# EasyEDA Pro project 内机V10_1.epro, schematic 内机底板_1, sheets 4 to 6 of 6

## Sheets
4 ETHERNET: Page Size: A4
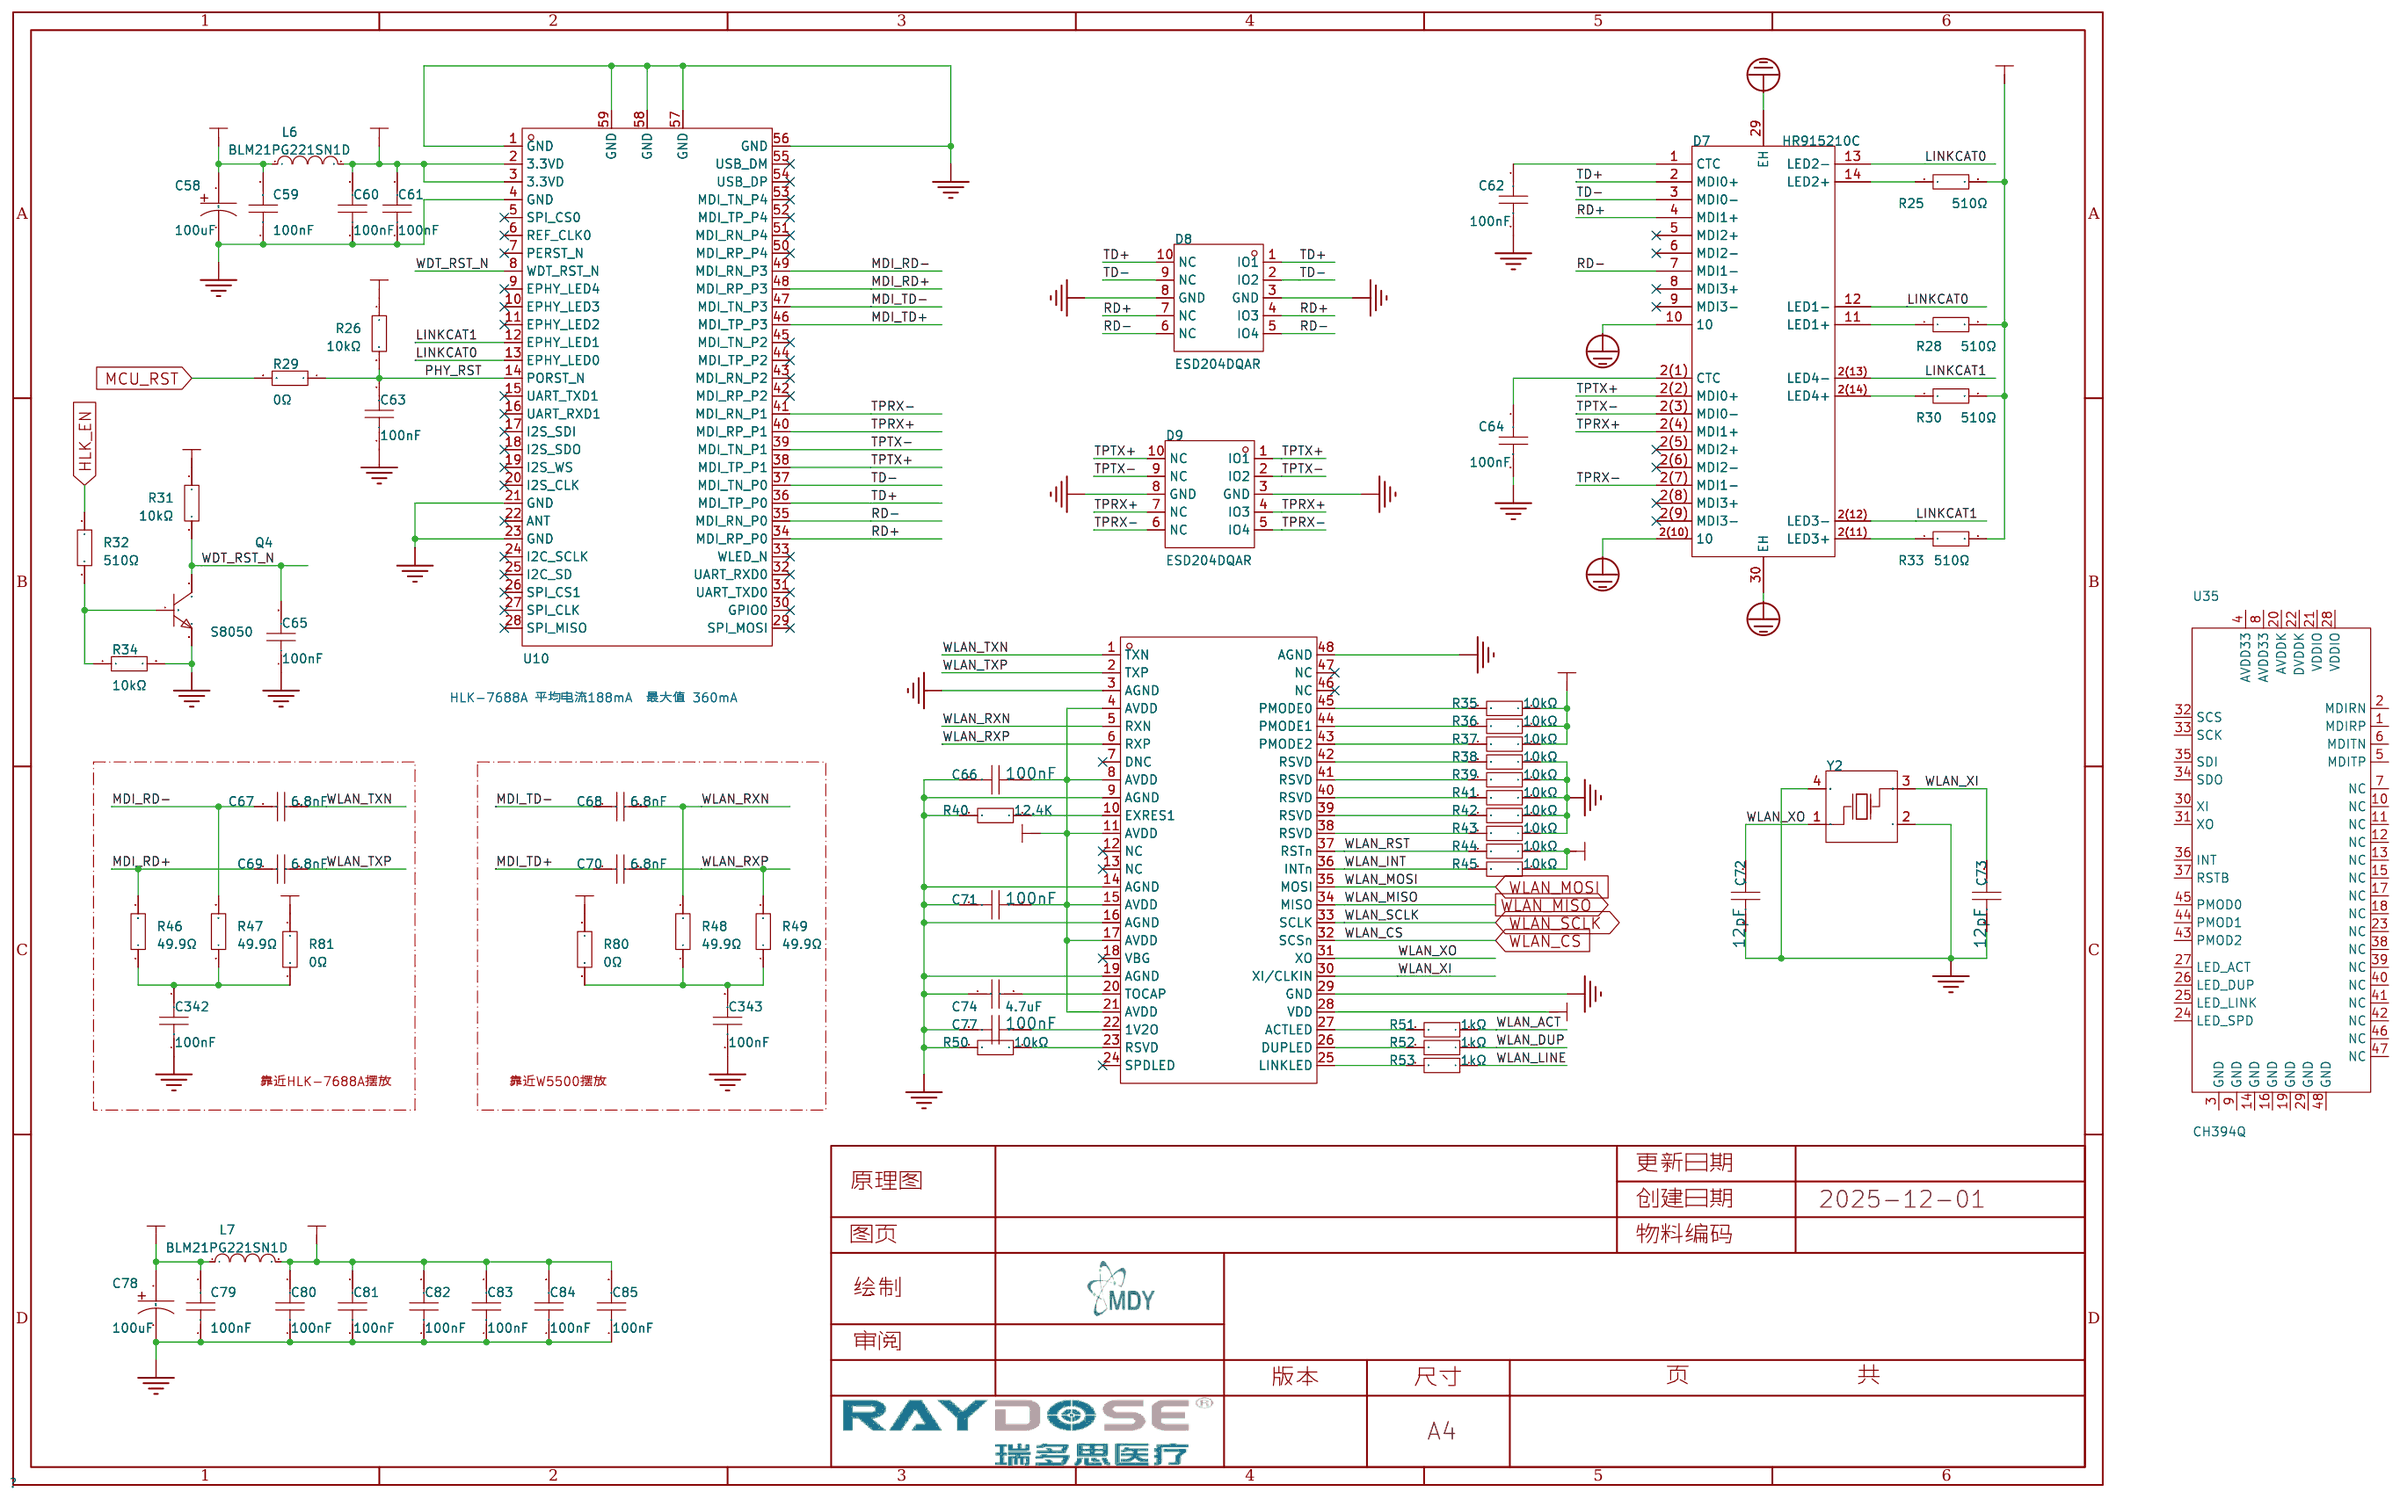
[diagram p3: ETHERNET]
5 INTERFACE
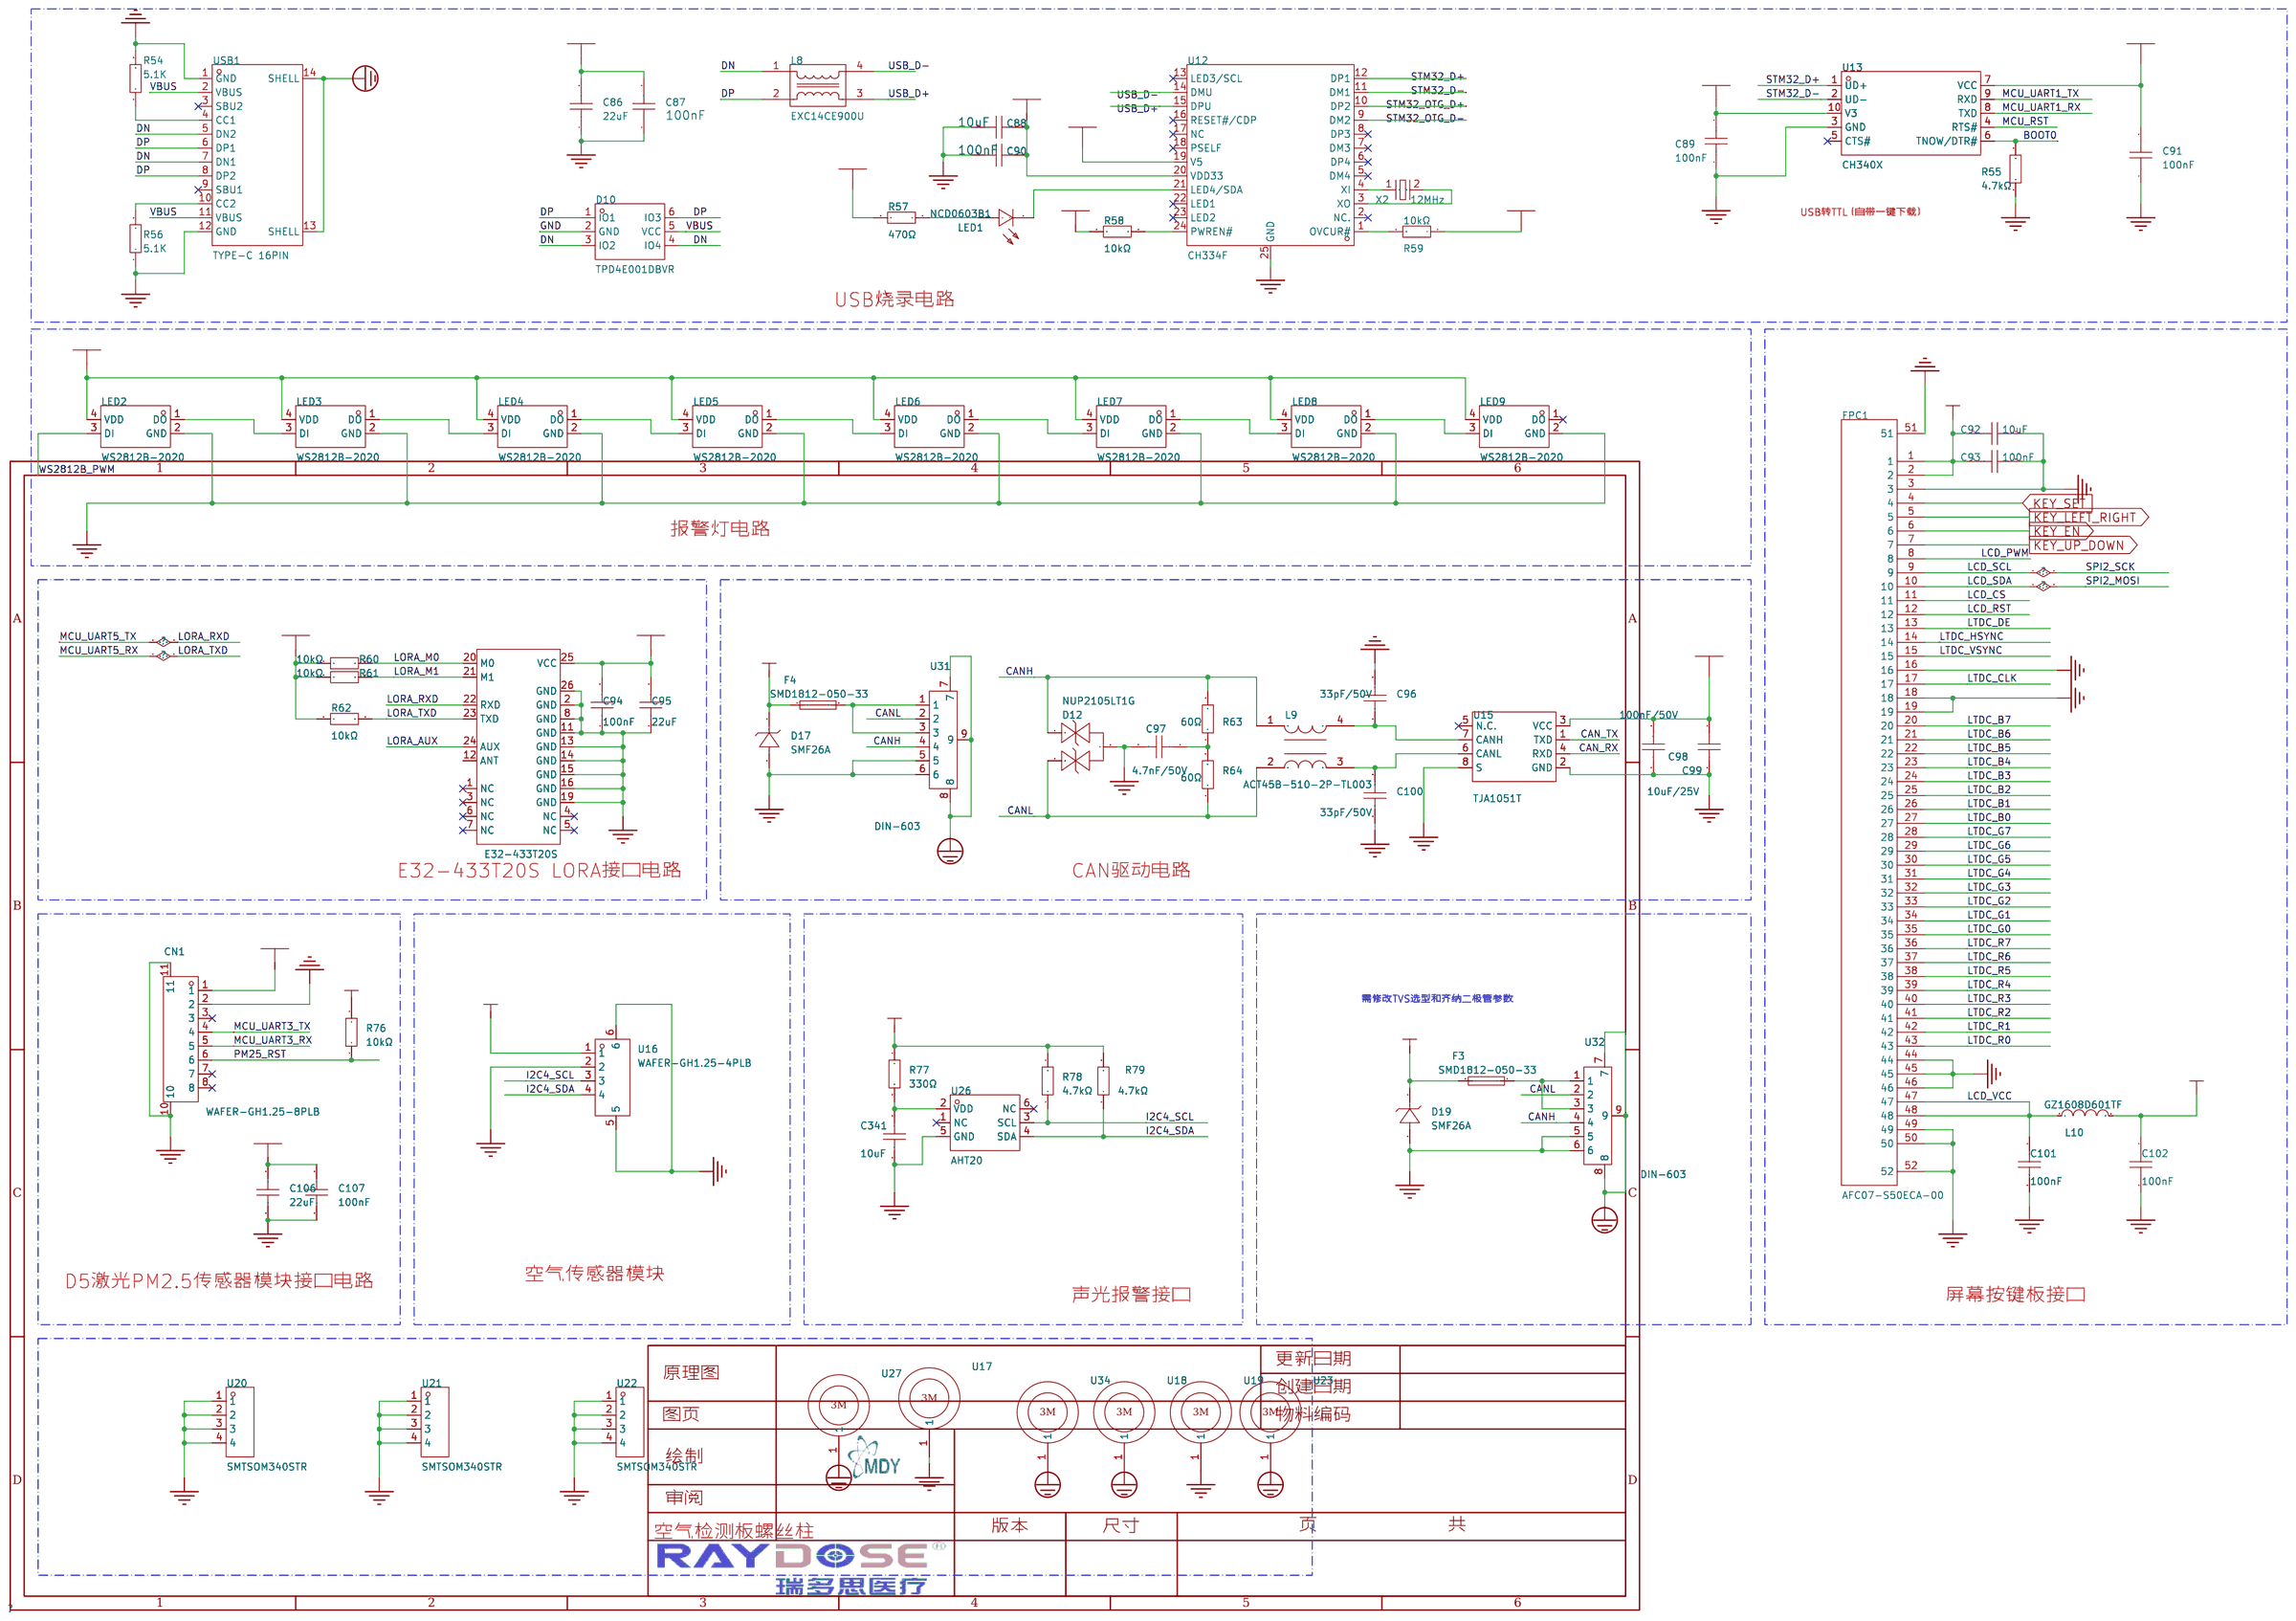
[diagram p4: INTERFACE]
6 SENSORS: Board Name: 内机V10; Create Date: 2025-09-10
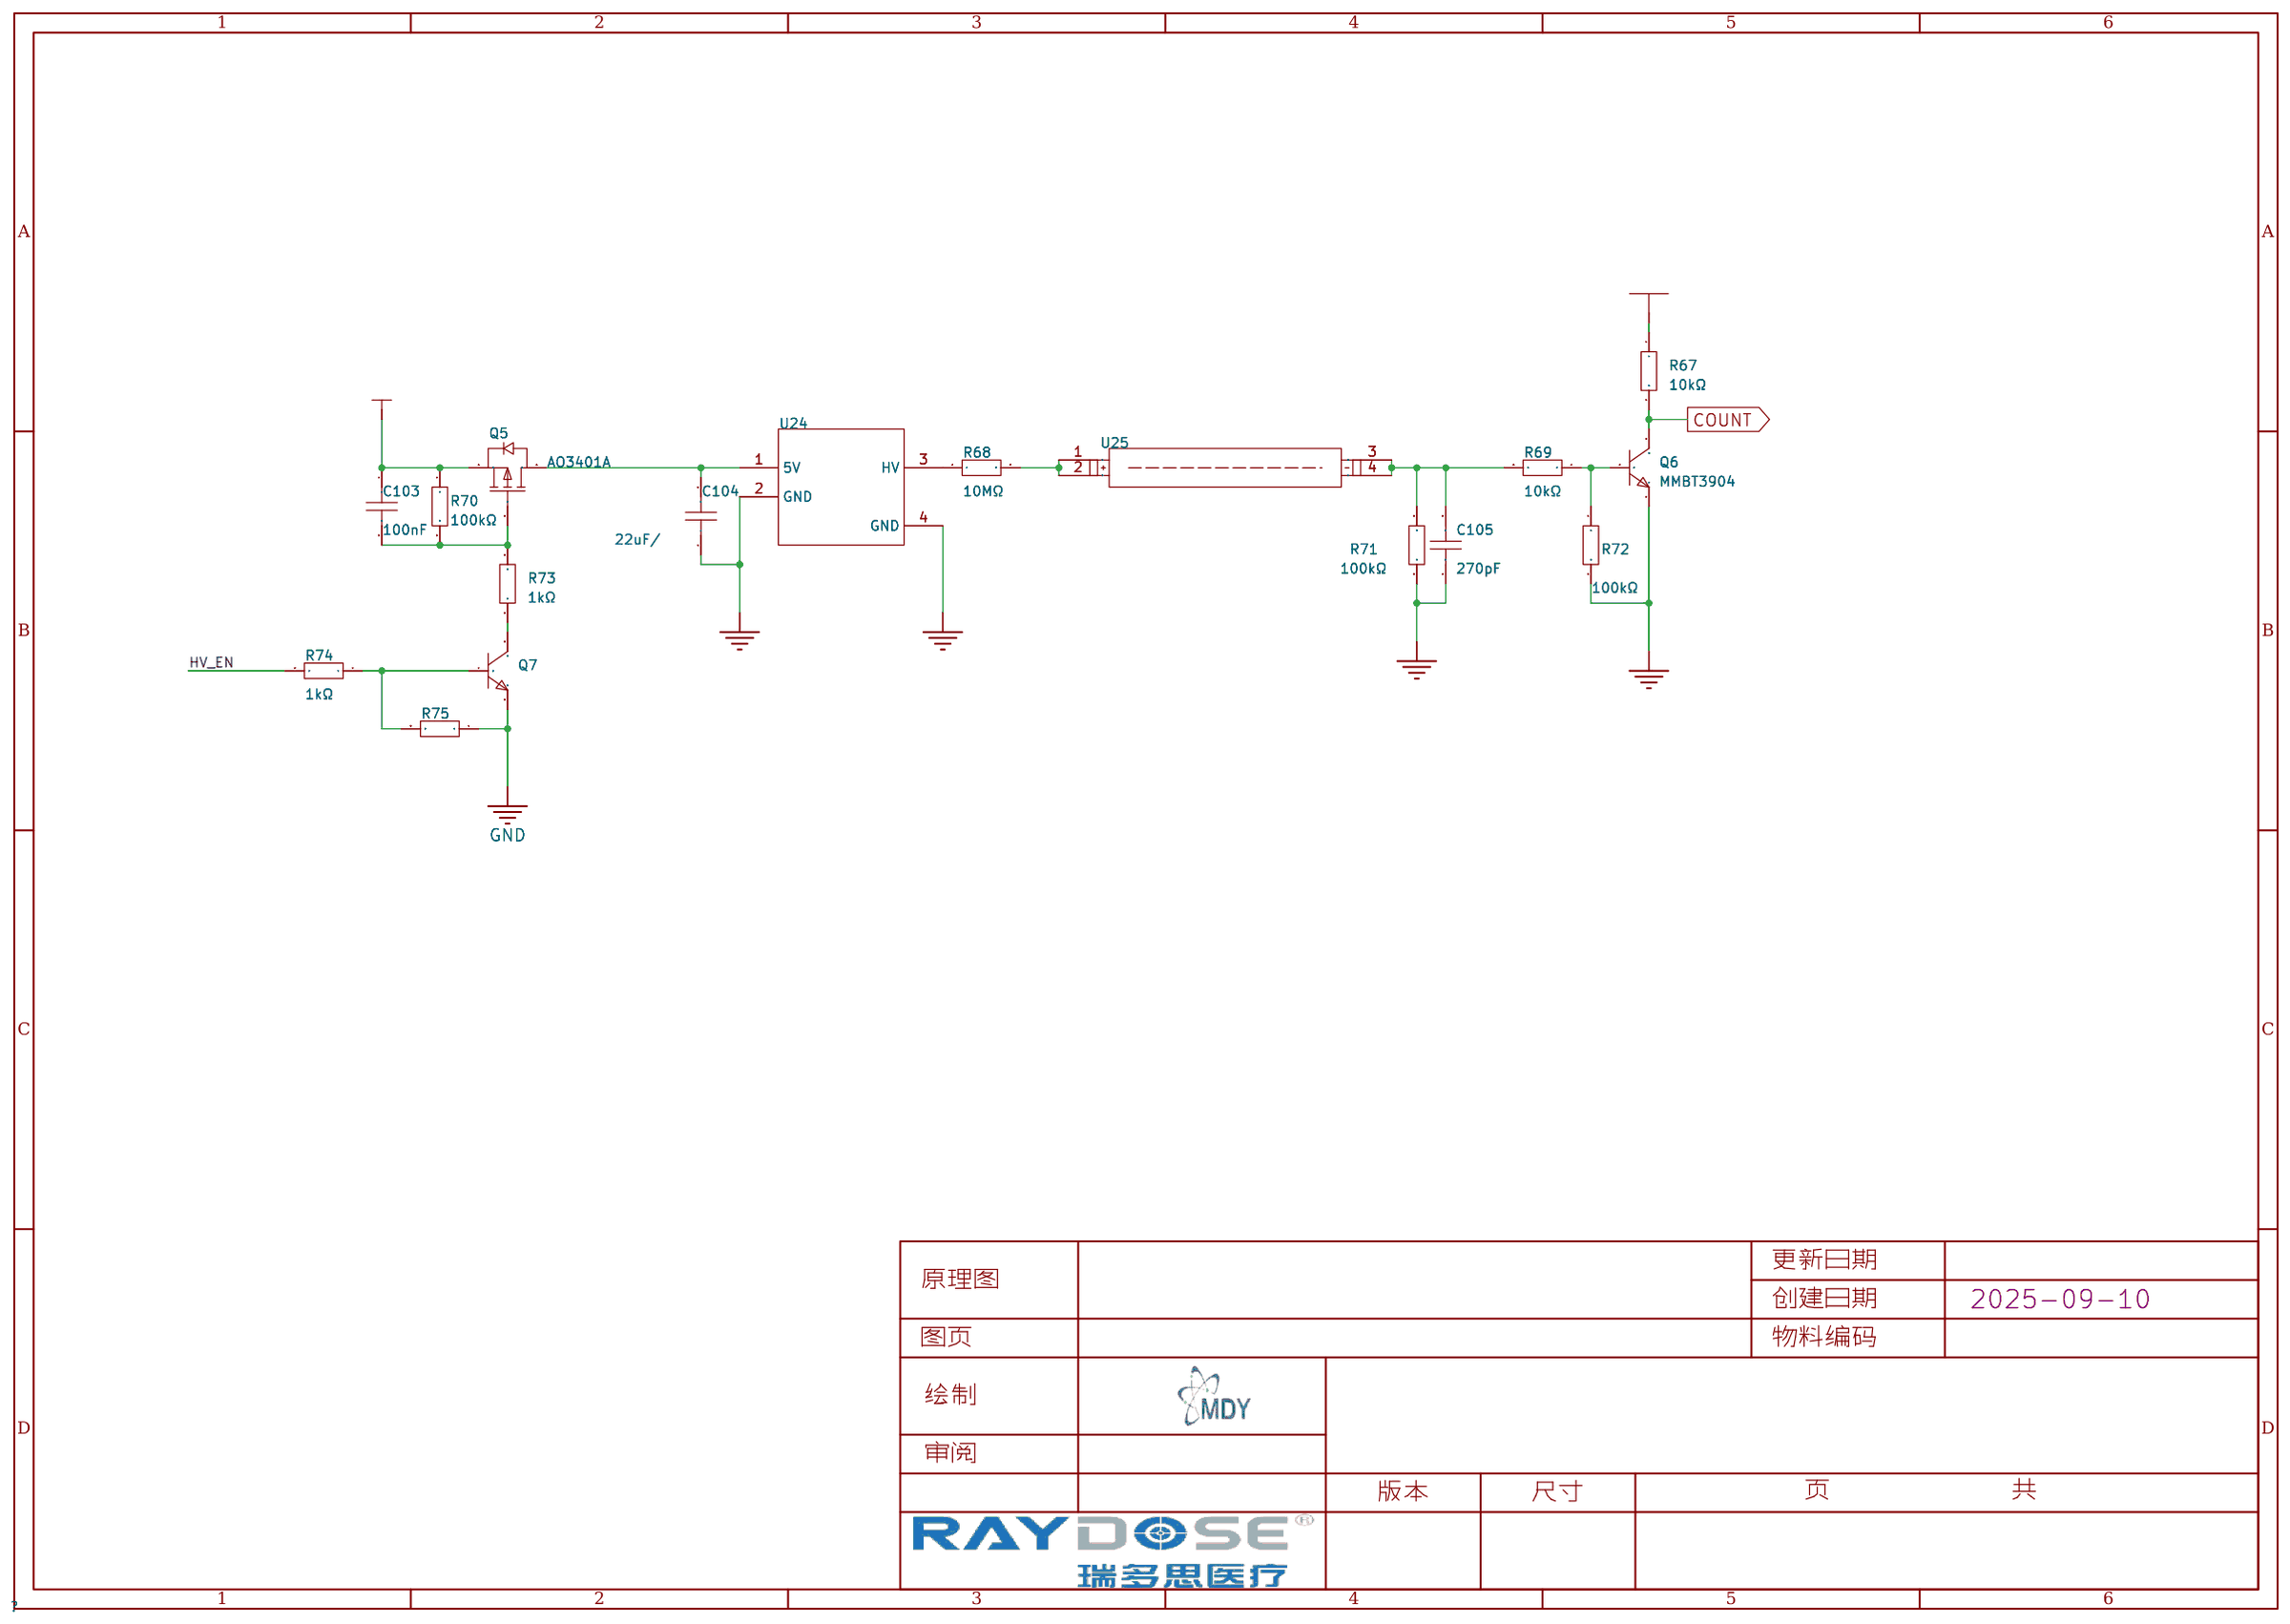
[diagram p5: SENSORS]

## Parts
sheet ETHERNET
C58  100uF  [CASE-B_3528]
C59  100nF  [C0603]
C60  100nF  [C0603]
C61  100nF  [C0603]
C62  100nF  [C0603]
C63  100nF  [C0603]
C64  100nF  [C0603]
C65  100nF  [C0603]
C66  100nF  [C0603]
C67  6.8nF  [C0603]
C68  6.8nF  [C0603]
C69  6.8nF  [C0603]
C70  6.8nF  [C0603]
C71  100nF  [C0603]
C72  12pF  [C0603_1]
C73  12pF  [C0603_1]
C74  4.7uF  [C0603]
C77  100nF  [C0603]
C78  100uF  [CASE-B_3528]
C79  100nF  [C0603]
C80  100nF  [C0603]
C81  100nF  [C0603]
C82  100nF  [C0603]
C83  100nF  [C0603]
C84  100nF  [C0603]
C85  100nF  [C0603]
C342  100nF  [C0603]
C343  100nF  [C0603]
D7  HR915210C  [RJ45-TH_HR915210C]
D8  ESD204DQAR  [USON-10_L2.5-W1.0-P0.50-BL]
D9  ESD204DQAR  [USON-10_L2.5-W1.0-P0.50-BL]
L6  BLM21PG221SN1D  [L0805]
L7  BLM21PG221SN1D  [L0805]
Q4  S8050  [SOT-23-3_L3.0-W1.7-P0.95-LS2.9-BR]
R25  510Ω  [R0603]
R26  10kΩ  [R0603]
R28  510Ω  [R0603]
R29  0Ω  [R0603]
R30  510Ω  [R0603]
R31  10kΩ  [R0603]
R32  510Ω  [R0603]
R33  510Ω  [R0603]
R34  10kΩ  [R0603]
R35  10kΩ  [R0603]
R36  10kΩ  [R0603]
R37  10kΩ  [R0603]
R38  10kΩ  [R0603]
R39  10kΩ  [R0603]
R40  12.4K  [R0603]
R41  10kΩ  [R0603]
R42  10kΩ  [R0603]
R43  10kΩ  [R0603]
R44  10kΩ  [R0603]
R45  10kΩ  [R0603]
R46  49.9Ω  [R0603]
R47  49.9Ω  [R0603]
R48  49.9Ω  [R0603]
R49  49.9Ω  [R0603]
R50  10kΩ  [R0603]
R51  1kΩ  [R0603]
R52  1kΩ  [R0603]
R53  1kΩ  [R0603]
R80  0Ω  [R0603]
R81  0Ω  [R0603]
U10  2.412GHz；2.483GHz  [WIRELM-SMD_HLK-7688A]
U11  W5500  [LQFP-48_L7.0-W7.0-P0.50-LS9.0-BL]
U35  CH394Q  [LQFP-48_L7.0-W7.0-P0.50-LS9.0-TL]
Y2  25MHz  [CRYSTAL-SMD_4P-L3.2-W2.5-BL]
sheet INTERFACE
C86  22uF  [C0603_1]
C87  100nF  [C0603]
C88  10uF  [C0603]
C89  100nF  [C0603]
C90  100nF  [C0603]
C91  100nF  [C0603]
C92  10uF  [C0603]
C93  100nF  [C0603]
C94  100nF  [C0603]
C95  22uF  [C0805]
C96  33pF  [C0603]
C97  4.7nF  [C0603]
C98  100nF  [C0603]
C99  10uF  [C0805]
C100  33pF  [C0603]
C101  100nF  [C0603]
C102  100nF  [C0603]
C106  22uF  [C0805]
C107  100nF  [C0603]
C341  10uF  [C0603]
CN1  WAFER-GH1.25-8PLB  [CONN-SMD_8P-P1.25_WAFER-GH1.25-8PLB]
D10  TPD4E001DBVR  [SOT-23-6_L2.9-W1.6-P0.95-LS2.8-BL]
D12  NUP2105LT1G  [SOT-23-3_L2.9-W1.3-P1.90-LS2.4-BR]
D17  SMF26A  [SOD-123_L2.6-W1.8-LS3.7-RD]
D19  SMF26A  [SOD-123_L2.6-W1.8-LS3.7-RD]
F3  SMD1812-050-33  [F1812]
F4  SMD1812-050-33  [F1812]
FPC1  AFC07-S50ECA-00  [FPC-SMD_AFC07-S50ECA-00]
L8  EXC14CE900U  [FILTER-SMD_4P-L0.9-W0.7-P0.50-BL]
L9  ACT45B-510-2P-TL003  [IND-SMD_4P-L4.5-W3.2-TL]
L10  GZ1608D601TF  [L0603]
LED1  NCD0603B1  [LED0603-RD]
LED2  WS2812B-2020  [LED-SMD_4P-L2.0-W2.0-TL_WS2812B-2020]
LED3  WS2812B-2020  [LED-SMD_4P-L2.0-W2.0-TL_WS2812B-2020]
LED4  WS2812B-2020  [LED-SMD_4P-L2.0-W2.0-TL_WS2812B-2020]
LED5  WS2812B-2020  [LED-SMD_4P-L2.0-W2.0-TL_WS2812B-2020]
LED6  WS2812B-2020  [LED-SMD_4P-L2.0-W2.0-TL_WS2812B-2020]
LED7  WS2812B-2020  [LED-SMD_4P-L2.0-W2.0-TL_WS2812B-2020]
LED8  WS2812B-2020  [LED-SMD_4P-L2.0-W2.0-TL_WS2812B-2020]
LED9  WS2812B-2020  [LED-SMD_4P-L2.0-W2.0-TL_WS2812B-2020]
R54  5.1K  [R0603]
R55  4.7kΩ  [R0603]
R56  5.1K  [R0603]
R57  470Ω  [R0603]
R58  10kΩ  [R0603]
R59  10kΩ  [R0603]
R60  10kΩ  [R0603]
R61  10kΩ  [R0603]
R62  10kΩ  [R0603]
R63  60Ω  [R0603]
R64  60Ω  [R0603]
R76  10kΩ  [R0603]
R77  330Ω  [R0603]
R78  4.7kΩ  [R0603]
R79  4.7kΩ  [R0603]
U12  CH334F  [QFN-24_L4.0-W4.0-P0.50-BL-EP2.8]
U13  CH340X  [MSOP-10_L3.0-W3.0-P0.50-LS5.0-BL]
U14  E32-433T20S  [WIRELM-SMD_E32-433T20S]
U15  TJA1051T  [SOP-8_L4.9-W3.9-P1.27-LS6.0-BL]
U16  WAFER-GH1.25-4PLB  [CONN-SMD_4P-P1.25_XUNPU_WAFER-GH1.25-4PLB]
U17  -  [3M螺丝孔]
U18  -  [3M螺丝孔]
U19  -  [3M螺丝孔]
U20  SMTSOM340STR  [SMD_BD6.2-D4.1]
U21  SMTSOM340STR  [SMD_BD6.2-D4.1]
U22  SMTSOM340STR  [SMD_BD6.2-D4.1]
U23  -  [3M螺丝孔]
U26  AHT20  [SENSOR-SMD_L3.0-W3.0-P1.00-BR]
U27  -  [3M螺丝孔]
U31  DIN-603  [PS2-TH_DIN_603]
U32  DIN-603  [PS2-TH_DIN_603]
U34  -  [3M螺丝孔]
USB1  TYPE-C 16PIN  [USB-C-SMD_TYPE-C-6PIN-2MD-073]
X2  12MHz  [CRYSTAL-SMD_L5.0-W3.2-1]
sheet SENSORS
C103  100nF  [C0603]
C104  22uF  [C0805]
C105  270pF  [C1206]
Q5  AO3401A  [SOT-23_L2.9-W1.3-P1.90-LS2.4-BR]
Q6  MMBT3904  [SOT-23-3_L2.9-W1.3-P1.90-LS2.4-BR]
Q7  S8050 J3Y(RANGE:200-350)  [SOT-23-3_L3.0-W1.7-P0.95-LS2.9-BR]
R67  10kΩ  [R0603]
R68  10MΩ  [R0805]
R69  10kΩ  [R0603]
R70  100kΩ  [R0603]
R71  100kΩ  [R0805]
R72  100kΩ  [R0603]
R73  1kΩ  [R0603]
R74  1kΩ  [R0603]
R75  10kΩ  [R0603]
U24  -  [反激电源模块_5v升压400v]
U25  -  [盖革管4313]

## Library data of the parts
C58 C78 = T491B107K010AT: 容值:100uF;精度:±10%;额定电压:10V;等效串联电阻:1.2Ω@100kHz;; LCSC Part Name: 100uF ±10% 10V; Supplier Part: C122271; Manufacturer: KEMET(基美); Supplier Footprint: CASE-B-3528; JLCPCB Part Class: 扩展库; Datasheet: https://atta.szlcsc.com/upload/public/pdf/source/20171212/C146203_15130638656111177810.pdf; Supplier: LCSC; Tolerance: ±10%; Rated Voltage: 10V; Equivalent Series Resistance(ESR): 1.2Ω@100kHz; Operating Temperature: -55℃~+125℃
C59-C65 C79-C85 C89 C91 C93 C94 C107 C342 C343 = CC0603KRX7R9BB104: 容值:100nF;精度:±10%;额定电压:50V;材质(温度系数):X7R;; LCSC Part Name: 100nF ±10% 50V; Supplier Part: C14663; Manufacturer: YAGEO(国巨); Supplier Footprint: 0603; JLCPCB Part Class: 基础库; Datasheet: https://atta.szlcsc.com/upload/public/pdf/source/20180910/C282072_33301C7F631E79921B82A8DAC6BCC5B3.pdf; Supplier: LCSC; Tolerance: ±10%; Voltage Rated: 50V; Temperature Coefficient: X7R
C66 C71 C77 C87 C90 = CC0603KRX7R9BB104: 容值:100nF;精度:±10%;额定电压:50V;温度系数:X7R;; LCSC Part Name: 100nF ±10% 50V; Supplier Part: C14663; Manufacturer: YAGEO(国巨); Supplier Footprint: 0603; JLCPCB Part Class: 基础库; Datasheet: https://atta.szlcsc.com/upload/public/pdf/source/20180910/C282072_33301C7F631E79921B82A8DAC6BCC5B3.pdf; Supplier: LCSC; Tolerance: ±10%; Voltage Rated: 50V; Temperature Coefficient: X7R; Check: true; Voltage Rating: 50V
C67-C70 = 0603B682K500NT: 容值:6.8nF;精度:±10%;额定电压:50V;温度系数:X7R;; LCSC Part Name: 6.8nF ±10% 50V; Supplier Part: C1631; Manufacturer: FH(风华); Supplier Footprint: 0603; JLCPCB Part Class: 基础库; Datasheet: https://atta.szlcsc.com/upload/public/pdf/source/20200305/C486355_26A10D38EF8C2A5C37091D0039909270.pdf; Supplier: LCSC; Tolerance: ±10%; Voltage Rating: 50V; Temperature Coefficient: X7R
C72 C73 = 0603B104K500NT: 容值:100nF;精度:±10%;额定电压:50V;材质(温度系数):X7R;; LCSC Part Name: 100nF ±10% 50V; Supplier Part: C30926; Manufacturer: FH(风华); Supplier Footprint: 0603; JLCPCB Part Class: Extended Part; Datasheet: https://atta.szlcsc.com/upload/public/pdf/source/20170923/C30926_1506149436298988724.pdf; Supplier: LCSC; Tolerance: ±10%; Voltage Rated: 50V; Temperature Coefficient: X7R; Check: true
C74 = CL10A475KO8NNNC: 容值:4.7uF;精度:±10%;额定电压:16V;材质(温度系数):X5R;; LCSC Part Name: 4.7uF ±10% 16V; Supplier Part: C19666; Manufacturer: SAMSUNG(三星); Supplier Footprint: 0603; JLCPCB Part Class: 基础库; Datasheet: https://atta.szlcsc.com/upload/public/pdf/source/20160218/1457707763339.pdf; Supplier: LCSC; Tolerance: ±10%; Voltage Rated: 16V; Temperature Coefficient: X5R
D7 = HR915210C: 连接器类型:RJ45插座;端口数量:2;安装方式:弯插;屏蔽:有屏蔽;LED:带LED;等级:-;触头材质:-;触头镀层:-;工作温度范围:0℃~+70℃;焊接温度(最大值):-;; LCSC Part Name: 弯插 带LED; Supplier Part: C2760331; Manufacturer: HANRUN(汉仁); Supplier Footprint: 插件; JLCPCB Part Class: 扩展库; Datasheet: https://atta.szlcsc.com/upload/public/pdf/source/20210316/C2760331_4D9CC28882E2EACAC9CE7FA17F2B9B05.pdf; Supplier: LCSC; Connector Type: RJ45插座; Number of Ports: 2; Mounting Style: 弯插; Shielding: 有屏蔽; LED: 带LED; Operating Temperature Range: 0℃~+70℃
D8 D9 = ESD204DQAR: 反向截止电压(Vrwm):3.6V;最大钳位电压:11.5V;峰值脉冲功率(Ppp)@10/1000us:50W;击穿电压:5V;; Supplier Part: C553132; Manufacturer: TI(德州仪器); Supplier Footprint: USON-10(1x2.5); JLCPCB Part Class: 扩展库; Datasheet: https://www.ti.com/cn/lit/gpn/esd204; Supplier: LCSC; Reverse Stand-Off Voltage (Vrwm): 3.6V; Maximum Clamping Voltage: 11.5V; Peak Pulse Power Dissipation (Ppp)@10/1000us: 50W; Breakdown Voltage: 5V; Operating Temperature: -40℃~+125℃@(Ta); Type: ESD
L6 L7 = BLM21PG221SN1D: 标称阻抗@测试频率:220Ω@100MHz;误差:±25%;直流电阻(RDC):45mΩ;; LCSC Part Name: 单路 0805磁珠 阻抗220Ω@100MHz; Supplier Part: C85840; Manufacturer: muRata(村田); Supplier Footprint: 0805; JLCPCB Part Class: 扩展库; Datasheet: https://atta.szlcsc.com/upload/public/pdf/source/20180326/C118443_3FAC30E9A4F0E6B81275543C61E0685E.pdf; Supplier: LCSC; Impedance @ Frequency: 220Ω@100MHz; Tolerance: ±25%; DC Resistance: 45mΩ; Current Rating: 2A; Circuits: 1
Q4 = S8050 J3Y(RANGE:200-350): 晶体管类型:NPN;集电极电流(Ic):500mA;集射极击穿电压(Vceo):25V;耗散功率(Pd):300mW;直流电流增益(hFE):200@500mA,1V;; LCSC Part Name: H档(200-350) NPN 电流:0.5A 电压:25V; Supplier Part: C2146; Manufacturer: CJ(江苏长电/长晶); Supplier Footprint: SOT-23; JLCPCB Part Class: 基础库; Datasheet: https://item.szlcsc.com/datasheet/S8050%2520J3Y(RANGE%253A200-350)/2503.html; Supplier: LCSC; type: NPN; Current - Collector(Ic): 500mA; Collector - Emitter Voltage VCEO: 25V; Pd - Power Dissipation: 300mW; DC Current Gain: 200@500mA,1V; Transition frequency(fT): 150MHz; Current - Collector Cutoff: 100nA; Vce Saturation(VCE(sat)): 600mV@500mA,50mA; Operating Temperature: -55℃~+150℃; Emitter-Base Voltage(Vebo): 5V; Number: 1个NPN
R25 R28 R30 R32 R33 = 0603WAF5100T5E: 电阻类型:厚膜电阻;阻值:510Ω;精度:±1%;功率:100mW;最大工作电压:75V;温度系数:±100ppm/℃;; LCSC Part Name: 510Ω ±1% 100mW 厚膜电阻; Supplier Part: C23193; Manufacturer: UNI-ROYAL(厚声); Supplier Footprint: 0603; JLCPCB Part Class: 基础库; Datasheet: https://atta.szlcsc.com/upload/public/pdf/source/20200306/C422600_1E6D84923E4A46A82E41ADD87F860B5C.pdf; Supplier: LCSC; Type: 厚膜电阻; Tolerance: ±1%; Power(Watts): 100mW; Overload Voltage (Max): 75V; Temperature Coefficient: ±100ppm/℃; Operating Temperature Range: -55℃~+155℃
R26 R31 R34 R60-R62 R67 R69 R75 R76 = 0603WAF1002T5E: 电阻类型:厚膜电阻;阻值:10kΩ;精度:±1%;功率:100mW;最大工作电压:75V;温度系数:±100ppm/℃;; LCSC Part Name: 厚膜电阻 10kΩ ±1% 100mW; Supplier Part: C25804; Manufacturer: UNI-ROYAL(厚声); Supplier Footprint: 0603; JLCPCB Part Class: Basic Part; Datasheet: https://atta.szlcsc.com/upload/public/pdf/source/20200306/C422600_1E6D84923E4A46A82E41ADD87F860B5C.pdf; Supplier: LCSC; Type: 厚膜电阻; Tolerance: ±1%; Power(Watts): 100mW; Overload Voltage (Max): 75V; Temperature Coefficient: ±100ppm/℃; Operating Temperature Range: -55℃~+155℃
R29 R80 R81 = 0603WAF0000T5E: 电阻类型:厚膜电阻;阻值:0Ω;精度:±1%;功率:100mW;最大工作电压:75V;; LCSC Part Name: 0Ω ±1% 100mW 厚膜电阻; Supplier Part: C21189; Manufacturer: UNI-ROYAL(厚声); Supplier Footprint: 0603; JLCPCB Part Class: 基础库; Datasheet: https://atta.szlcsc.com/upload/public/pdf/source/20200306/C422600_1E6D84923E4A46A82E41ADD87F860B5C.pdf; Supplier: LCSC; Type: 厚膜电阻; Tolerance: ±1%; Power(Watts): 100mW; Overload Voltage (Max): 75V; Operating Temperature Range: -55℃~+155℃
R35-R39 R41-R45 R50 R58 R59 = 0603WAF1002T5E: 电阻类型:厚膜电阻;阻值:10kΩ;精度:±1%;功率:100mW;最大工作电压:75V;温度系数:±100ppm/℃;; LCSC Part Name: 厚膜电阻 10kΩ ±1% 100mW; Supplier Part: C25804; Manufacturer: UNI-ROYAL(厚声); Supplier Footprint: 0603; JLCPCB Part Class: Basic Part; Datasheet: https://atta.szlcsc.com/upload/public/pdf/source/20200306/C422600_1E6D84923E4A46A82E41ADD87F860B5C.pdf; Supplier: LCSC; Type: 厚膜电阻; Tolerance: ±1%; Power(Watts): 100mW; Overload Voltage (Max): 75V; Temperature Coefficient: ±100ppm/℃; Operating Temperature Range: -55℃~+155℃; Check: true
R40 = AECR0805F1M00K9: 电阻类型:厚膜电阻;阻值:1M;精度:±1%;功率:125mW;温度系数:±100ppm/;最大工作电压:150V;工作温度范围:-55~+125;; LCSC Part Name: 0R; Supplier Part: C328386; Manufacturer: RESI(开步睿思）; Supplier Footprint: 0805; Datasheet: https://atta.szlcsc.com/upload/public/pdf/source/20181108/C328386_8056536101292A650F3268E3B3E068CE.pdf; Supplier: LCSC; Type: 厚膜电阻; Tolerance: ±1%; Power(Watts): 125mW; Temperature Coefficient: ±100ppm/; Overload Voltage (Max): 150V; Operating Temperature Range: -55~+125; JLCPCB Part Class: Extended Part; Check: true
R46-R49 = 0603WAF499JT5E: 电阻类型:厚膜电阻;阻值:49.9Ω;精度:±1%;功率:100mW;工作电压:75V;温度系数:±100ppm/℃;; LCSC Part Name: 49.9Ω ±1% 100mW 厚膜电阻; Supplier Part: C23185; Manufacturer: UNI-ROYAL(厚声); Supplier Footprint: 0603; JLCPCB Part Class: 基础库; Datasheet: https://item.szlcsc.com/datasheet/0603WAF499JT5E/23912.html; Supplier: LCSC; Type: 厚膜电阻; Tolerance: ±1%; Power(Watts): 100mW; Voltage-Supply(Max): 75V; Temperature Coefficient: ±100ppm/℃; Operating Temperature: -55℃~+155℃
R51-R53 = 0603WAF1001T5E: 电阻类型:厚膜电阻;阻值:1kΩ;精度:±1%;功率:100mW;最大工作电压:75V;温度系数:±100ppm/℃;; LCSC Part Name: 1kΩ ±1% 100mW 厚膜电阻; Supplier Part: C21190; Manufacturer: UNI-ROYAL(厚声); Supplier Footprint: 0603; JLCPCB Part Class: Basic Part; Datasheet: https://atta.szlcsc.com/upload/public/pdf/source/20200306/C422600_1E6D84923E4A46A82E41ADD87F860B5C.pdf; Supplier: LCSC; Type: 厚膜电阻; Tolerance: ±1%; Power(Watts): 100mW; Overload Voltage (Max): 75V; Temperature Coefficient: ±100ppm/℃; Operating Temperature Range: -55℃~+155℃; Check: true
U10 = HLK-7688A: 核心芯片:MT7688AN芯片;频率:2.412GHz；2.483GHz;天线形式:-;发射功率:20dBm;接收灵敏度:-;; LCSC Part Name: 网口路由WIFI模块 天线配件HLK-TX-PCB-B; Supplier Part: C209919; Manufacturer: HI-LINK(海凌科); JLCPCB Part Class: 扩展库; Datasheet: https://atta.szlcsc.com/upload/public/pdf/source/20250327/6E4B9EDE596D8DAC5EED69D970B3F30A.pdf; Supplier: LCSC; Utilized IC / Part: MT7688AN芯片; Interface Type: UART；SPI；I2C；USB; Output Power: 20dBm; Voltage - Supply: 3.3V; Operating Temperature: -20℃~+60℃
U11 = W5500: 应用功能:控制器;通道数:-;接口类型:SPI;; LCSC Part Name: 硬连线TCP/IP嵌入式以太网控制器; Supplier Part: C32843; Manufacturer: WIZNET; Supplier Footprint: LQFP-48(7x7); JLCPCB Part Class: 扩展库; Datasheet: https://atta.szlcsc.com/upload/public/pdf/source/20230714/E10C32B058E0BA54FCE1C1556BE10C07.pdf; Supplier: LCSC; Application Function: 控制器; Interface: SPI; Supply Voltage: 2.97V~3.63V; Supply Current: 132mA; Operating Temperature: -40℃~+85℃
U35 = CH394Q: TCP/IP以太网协议栈芯片，通过SPI接口拓展以太网通信功能。集成10/100M MAC和PHY收发器，支持Auto-MDIX，内置ARP、ICMP、IGMP、UDP、TCP等协议固件，提供8个socket，I/O口支持3.3V、2.5V、1.8V供电。; LCSC Part Name: 以太网协议栈芯片; Supplier Part: C46061830; Manufacturer: WCH(南京沁恒); Supplier Footprint: LQFP-48(7x7); JLCPCB Part Class: 扩展库; Datasheet: https://item.szlcsc.com/datasheet/CH394Q/48170819.html; Supplier: LCSC; Number of Channels: 8; Voltage - Supply: 1.8V；3.3V；2.5V; Integrated PHY: 是; Communication Interface: SPI; Memory Space: 32KB; Ethernet Speed Standards: 10BASE-T；100BASE-TX
Y2 = X322525MOB4SI: 晶振类型:贴片晶振;频率:25MHz;常温频差:±10ppm;负载电容:12pF;频率稳定度:±20ppm;; LCSC Part Name: YSX321SL 25MHZ 4P 3225 12PF ±10PPM -40~85℃ (±20PPM); Supplier Part: C9006; Manufacturer: YXC(扬兴晶振); Supplier Footprint: SMD3225-4P; JLCPCB Part Class: Basic Part; Datasheet: https://atta.szlcsc.com/upload/public/pdf/source/20240329/19D5F850207469550BEB00D7DFEDBC7A.pdf; Supplier: LCSC; Crystal Type: 贴片晶振; Normal temperature Frequency Tolerance: ±10ppm; Load Capacitor: 12pF; Frequency Stability(Full temperature range): ±20ppm; Operating Temperature: -40℃~+85℃; External load capacitor: 12pF; Type: 贴片晶振; Load Capacitance: 12pF; Frequency Stability: ±20ppm
C86 = CGA0603X5R226M160JT: 容值:22uF;精度:±20%;额定电压:16V;温度系数:X5R;; LCSC Part Name: 22uF ±20% 16V; Supplier Part: C6119868; Manufacturer: HRE(芯声); Supplier Footprint: 0603; JLCPCB Part Class: Extended Part; Datasheet: https://atta.szlcsc.com/upload/public/pdf/source/20250121/36E435B8815E1026A710792D223DB526.pdf; Supplier: LCSC; Tolerance: ±20%; Voltage Rated: 16V; Temperature Coefficient: X5R; Voltage Rating: 16V
C88 = CL10A106MA8NRNC: 容值:10uF;精度:±20%;额定电压:25V;材质(温度系数):X5R;; LCSC Part Name: 10uF ±20% 25V; Supplier Part: C96446; Manufacturer: SAMSUNG(三星); Supplier Footprint: 0603; JLCPCB Part Class: 基础库; Datasheet: https://atta.szlcsc.com/upload/public/pdf/source/20160218/1457707763339.pdf; Supplier: LCSC; Tolerance: ±20%; Voltage Rated: 25V; Temperature Coefficient: X5R; Check: true
C92 = CL10A106KP8NNNC: 容值:10uF;精度:±10%;额定电压:10V;温度系数:X5R;; LCSC Part Name: 10uF ±10% 10V; Supplier Part: C19702; Manufacturer: SAMSUNG(三星); Supplier Footprint: 0603; JLCPCB Part Class: 基础库; Datasheet: https://item.szlcsc.com/datasheet/CL10A106KP8NNNC/20411.html; Supplier: LCSC; Tolerance: ±10%; Voltage Rating: 10V; Temperature Coefficient: X5R
C95 C104 C106 = CL21A226MAQNNNE: 容值:22uF;精度:±20%;额定电压:25V;材质(温度系数):X5R;; LCSC Part Name: 22uF ±20% 25V; Supplier Part: C45783; Manufacturer: SAMSUNG(三星); Supplier Footprint: 0805; JLCPCB Part Class: Basic Part; Datasheet: https://atta.szlcsc.com/upload/public/pdf/source/20160218/1457707763339.pdf; Supplier: LCSC; Tolerance: ±20%; Voltage Rated: 25V; Temperature Coefficient: X5R
C96 C100 = CL10C330JB8NNNC: 容值:33pF;精度:±5%;额定电压:50V;材质(温度系数):C0G;; LCSC Part Name: 33pF ±5% 50V; Supplier Part: C1663; Manufacturer: SAMSUNG(三星); Supplier Footprint: 0603; JLCPCB Part Class: 基础库; Datasheet: https://atta.szlcsc.com/upload/public/pdf/source/20160218/1457707763339.pdf; Supplier: LCSC; Tolerance: ±5%; Voltage Rated: 50V; Temperature Coefficient: C0G
C97 = 0603B472K500NT: 容值:4.7nF;精度:±10%;额定电压:50V;材质(温度系数):X7R;; LCSC Part Name: 4.7nF ±10% 50V; Supplier Part: C53987; Manufacturer: FH(风华); Supplier Footprint: 0603; JLCPCB Part Class: Basic Part; Datasheet: https://atta.szlcsc.com/upload/public/pdf/source/20200305/C486355_26A10D38EF8C2A5C37091D0039909270.pdf; Supplier: LCSC; Tolerance: ±10%; Voltage Rated: 50V; Temperature Coefficient: X7R
C98 C101-C103 = CC0603KRX7R9BB104: 容值:100nF;精度:±10%;额定电压:50V;材质(温度系数):X7R;; LCSC Part Name: 100nF ±10% 50V; Supplier Part: C14663; Manufacturer: YAGEO(国巨); Supplier Footprint: 0603; JLCPCB Part Class: Basic Part; Datasheet: https://atta.szlcsc.com/upload/public/pdf/source/20180910/C282072_33301C7F631E79921B82A8DAC6BCC5B3.pdf; Supplier: LCSC; Tolerance: ±10%; Voltage Rated: 50V; Temperature Coefficient: X7R
C99 = CL21A106KAYNNNE_C15850: 容值:10uF;精度:±10%;额定电压:25V;材质(温度系数):X5R;; LCSC Part Name: 10uF ±10% 25V; Supplier Part: C15850; Manufacturer: SAMSUNG(三星); Manufacturer Part: CL21A106KAYNNNE; Supplier Footprint: 0805; JLCPCB Part Class: Basic Part; Datasheet: https://atta.szlcsc.com/upload/public/pdf/source/20160218/1457707763339.pdf; Supplier: LCSC; Tolerance: ±10%; Voltage Rated: 25V; Temperature Coefficient: X5R
C341 = CL10A106MA8NRNC: 容值:10uF;精度:±20%;额定电压:25V;材质(温度系数):X5R;; LCSC Part Name: 10uF ±20% 25V; Supplier Part: C96446; Manufacturer: SAMSUNG(三星); Supplier Footprint: 0603; JLCPCB Part Class: 基础库; Datasheet: https://atta.szlcsc.com/upload/public/pdf/source/20160218/1457707763339.pdf; Supplier: LCSC; Tolerance: ±20%; Voltage Rated: 25V; Temperature Coefficient: X5R
CN1 = WAFER-GH1.25-8PLB: 插针结构:1x8P;间距:1.25mm;安装方式:立贴;参考系列:GH;总PIN数:8P;排数:1;每排PIN数:8;行距:-;额定电流:1A;触头材质:黄铜;触头镀层:-;工作温度:-25℃~+85℃;; LCSC Part Name: 1x8P 间距:1.25mm 立贴 系列:GH; Supplier Part: C3029374; Manufacturer: XUNPU(讯普); Supplier Footprint: SMD,P=1.25mm; JLCPCB Part Class: 扩展库; Datasheet: https://item.szlcsc.com/datasheet/WAFER-GH1.25-8PLB/3561386.html; Supplier: LCSC; Pins Structure: 1x8P; Pitch: 1.25mm; Mounting Type: 立贴; Reference Series: GH; Number of Pins: 8P; Number of Rows: 1; Number of PINs Per Row: 8; Current Rating: 1A; Contact Material: 黄铜; Operating Temperature: -25℃~+85℃; Voltage Rating: 125V; Plastic Material: LCP; Supplementary Features: 辅助焊脚; Color: 米色; Z-Height of the Board: 4.2mm; X-Length of Bottom Edge on Board (Spacing Line): 13.25mm; Y-Width of Bottom Edge on Board: 4.95mm
D10 = TPD4E001DBVR: 反向截止电压(Vrwm):5.5V;最大钳位电压:-;峰值脉冲功率(Ppp)@10/1000us:100W;击穿电压:11V;; Supplier Part: C465736; Manufacturer: TI(德州仪器); Supplier Footprint: SOT-23-6; JLCPCB Part Class: 扩展库; Datasheet: https://www.ti.com/cn/lit/gpn/tpd4e001; Supplier: LCSC; Reverse Stand-Off Voltage (Vrwm): 5.5V; Peak Pulse Power Dissipation (Ppp)@10/1000us: 100W; Breakdown Voltage: 11V; Operating Temperature: -40℃~+85℃@(Ta); Type: ESD
D12 = NUP2105LT1G_C2890118: Supplier Part: C2890118; Manufacturer: TECH PUBLIC(台舟); Supplier Footprint: SOT-23; JLCPCB Part Class: 扩展库; Datasheet: https://atta.szlcsc.com/upload/public/pdf/source/20210903/C2631C2D315C3B4D2530AFC6AAB84809.pdf; Supplier: LCSC
D17 D19 = SMF26A_C41376090: 极性:单向;反向截止电压(Vrwm):26V;钳位电压:42.1V;峰值脉冲电流(Ipp):4.8A;峰值脉冲功率(Ppp):200W;击穿电压:31.9V;; LCSC Part Name: 单向TVS 26V截止 峰值浪涌电流：4.8A; Supplier Part: C41376090; Manufacturer: 宏嘉诚; Supplier Footprint: SOD-123FL; JLCPCB Part Class: 扩展库; Datasheet: https://item.szlcsc.com/datasheet/SMF26A/43144807.html; Supplier: LCSC; Polarity: 单向; Reverse Stand-Off Voltage (Vrwm): 26V; Clamping Voltage: 42.1V; Peak Pulse Current (Ipp): 4.8A; Peak Pulse Power Dissipation (Ppp): 200W; Voltage - Breakdown: 31.9V; Reverse Leakage Current (Ir): 1uA; Number of Channels: 单路; Operating Temperature: -55℃~+150℃; level of protection: IEC 61000-4-2; Type: TVS
F3 F4 = SMD1812-050-33: 耐压(Vmax):33V;最大电流(Imax):40A;保持电流(Ihold):500mA;跳闸电流(Itrip):1A;; Supplier Part: C46641047; Manufacturer: 宏嘉诚; Supplier Footprint: 1812; JLCPCB Part Class: 扩展库; Datasheet: https://item.szlcsc.com/datasheet/SMD1812-050-33/48798753.html; Supplier: LCSC; Voltage - Max: 33V; Current - Max: 40A; Hold Current: 500mA; Trip Current: 1A; Power Dissipation: 1W; Resistance - Initial (Ri) (Min): 150mΩ; Resistance - Post Trip (R1) (Max): 1.4Ω; Time to Trip(Max): 150ms; Operating Temperature: -40℃~+85℃
FPC1 = AFC07-S50ECA-00: 锁定特性:抽屉式;触点类型:上接;触点数量:50P;间距:0.5mm;安装方式:卧贴;; LCSC Part Name: 间距:0.5mm P数:50P 抽屉式 上接; Supplier Part: C262650; Manufacturer: JS(钜硕电子); Supplier Footprint: SMD,P=0.5mm,卧贴; JLCPCB Part Class: 扩展库; Datasheet: https://item.szlcsc.com/datasheet/AFC07-S50ECA-00/253909.html; Supplier: LCSC; Locking Feature: 抽屉式; Contact Type: 上接; Number of Contacts: 50P; Pitch: 0.5mm; Mounting Type: 卧贴; FFC, FCB Thickness: 0.3mm; Height Above Board: 2mm
L8 = EXC14CE900U: 线路数:2;阻抗 @ 频率:90Ω@100MHz;直流电阻(DCR):2.5Ω;; LCSC Part Name: 两路 共模滤波器 阻抗90Ω@100MHz; Supplier Part: C178761; Manufacturer: PANASONIC(松下); Supplier Footprint: SMD-4P,0.8x0.6mm; JLCPCB Part Class: 扩展库; Datasheet: https://atta.szlcsc.com/upload/public/pdf/source/20180420/C178763_1B313D20029A4DF74B8E6D9ABB4E3A47.pdf; Supplier: LCSC; Number of Lines: 2; Withstanding Voltage: 125V; Current Rating: 130mA; Voltage Rating - DC: 5V; Impedance @ Frequency: 90Ω@100MHz; DC Resistance (DCR): 2.5Ω; Operating Temperature: -40℃~+85℃
L9 = ACT45B-510-2P-TL003: 线路数:2;电感 @ 频率:51uH@100kHz;阻抗 @ 频率:2.8kΩ@10MHz;直流电阻(DCR):1Ω;; LCSC Part Name: 两路 4532共模滤波器 阻抗2.8kΩ@10MHz; Supplier Part: C76584; Manufacturer: TDK; Supplier Footprint: SMD,4.5x3.2mm; JLCPCB Part Class: 扩展库; Datasheet: https://atta.szlcsc.com/upload/public/pdf/source/20160918/1474166842057.pdf; Supplier: LCSC; Number of Lines: 2; Withstanding Voltage: 250V@2Secs; Current Rating: 200mA; Inductance @ Frequency: 51uH@100kHz; Voltage Rating - DC: 50V; Impedance @ Frequency: 2.8kΩ@10MHz; DC Resistance (DCR): 1Ω; Operating Temperature: -40℃~+150℃
L10 = GZ1608D601TF: 阻抗 @ 频率:600Ω@100MHz;误差:±25%;直流电阻(DCR):450mΩ;; LCSC Part Name: 单路 0603磁珠 阻抗600Ω@100MHz; Supplier Part: C1002; Manufacturer: Sunlord(顺络); Supplier Footprint: 0603; JLCPCB Part Class: 基础库; Datasheet: https://atta.szlcsc.com/upload/public/pdf/source/20241120/893429B990C3BA07384E734821D2F218.pdf; Supplier: LCSC; Impedance @ Frequency: 600Ω@100MHz; Tolerance: ±25%; DC Resistance: 450mΩ; Current Rating: 200mA; Circuits: 1
LED1 = NCD0603B1: 发光颜色:蓝色;正向电压(VF):2.6V~3.6V;功率:72mW;正向电流:10mA;主波长:463nm~475nm;透镜颜色:无色透明透镜;发光强度:80mcd~220mcd;发光角度:130°;工作温度:-30℃~+85℃;; Supplier Part: C84266; Manufacturer: 国星光电; Supplier Footprint: 0603; JLCPCB Part Class: 扩展库; Datasheet: https://atta.szlcsc.com/upload/public/pdf/source/20200820/C84266_6A3CDBEFA72C6CAD68EDA53474ADAE6C.pdf; Supplier: LCSC; Emitted Color: 蓝色; Forward Voltage (VF): 2.6V~3.6V; Power Dissipation: 72mW; Forward Current: 10mA; Dominant Wavelength: 463nm~475nm; Lens Color: 无色透明透镜; Luminous Intensity: 80mcd~220mcd; Viewing Angle: 130°; Operating Temperature: -30℃~+85℃
LED2-LED9 = WS2812B-2020: 12mA，小尺寸，高亮，用于小间距，小尺寸产品（注意防潮，请查阅规格书中对应具体内容）; LCSC Part Name: RGB三色; Supplier Part: C965555; Manufacturer: worldsemi; Supplier Footprint: SMD,2.2x2mm; JLCPCB Part Class: 扩展库; Datasheet: https://item.szlcsc.com/datasheet/WS2812B-2020/1051115.html; Supplier: LCSC; Wavelength: 515.6nm；622.5nm；470.4nm; Luminous Intensity: 200mcd；160mcd；520mcd; Data Transmission Rate: 100KB/S; Voltage - Supply: 5V; Installation method: 正贴
R54 R56 = Res_0603: Supplier Footprint: 0603
R55 R78 R79 = 0603WAF4701T5E: 电阻类型:厚膜电阻;阻值:4.7kΩ;精度:±1%;功率:100mW;最大工作电压:75V;温度系数:±100ppm/℃;; LCSC Part Name: 4.7kΩ ±1% 100mW 厚膜电阻; Supplier Part: C23162; Manufacturer: UNI-ROYAL(厚声); Supplier Footprint: 0603; JLCPCB Part Class: Basic Part; Datasheet: https://atta.szlcsc.com/upload/public/pdf/source/20200306/C422600_1E6D84923E4A46A82E41ADD87F860B5C.pdf; Supplier: LCSC; Type: 厚膜电阻; Tolerance: ±1%; Power(Watts): 100mW; Overload Voltage (Max): 75V; Temperature Coefficient: ±100ppm/℃; Operating Temperature Range: -55℃~+155℃
R57 = 0603WAF4700T5E: 电阻类型:厚膜电阻;阻值:470Ω;精度:±1%;功率:100mW;最大工作电压:75V;温度系数:±100ppm/℃;; LCSC Part Name: 470Ω ±1% 100mW 厚膜电阻; Supplier Part: C23179; Manufacturer: UNI-ROYAL(厚声); Supplier Footprint: 0603; JLCPCB Part Class: 基础库; Datasheet: https://atta.szlcsc.com/upload/public/pdf/source/20200306/C422600_1E6D84923E4A46A82E41ADD87F860B5C.pdf; Supplier: LCSC; Type: 厚膜电阻; Tolerance: ±1%; Power(Watts): 100mW; Overload Voltage (Max): 75V; Temperature Coefficient: ±100ppm/℃; Operating Temperature Range: -55℃~+155℃
R63 R64 = RTT0360R0FTP: 电阻类型:厚膜电阻;阻值:60Ω;精度:±1%;功率:100mW;最大工作电压:75V;温度系数:±100ppm/℃;; LCSC Part Name: 厚膜电阻 60Ω ±1% 100mW; Supplier Part: C166918; Manufacturer: RALEC(旺诠); Supplier Footprint: 0603; JLCPCB Part Class: Extended Part; Datasheet: https://atta.szlcsc.com/upload/public/pdf/source/20180928/C303758_52AE496EA05AD4D633595C32F5A0EBAF.pdf; Supplier: LCSC; Type: 厚膜电阻; Tolerance: ±1%; Power(Watts): 100mW; Overload Voltage (Max): 75V; Temperature Coefficient: ±100ppm/℃; Operating Temperature Range: -55℃~+155℃
R77 = 0603WAF3300T5E: 电阻类型:厚膜电阻;阻值:330Ω;精度:±1%;功率:100mW;最大工作电压:75V;温度系数:±100ppm/℃;; LCSC Part Name: 330Ω ±1% 100mW 厚膜电阻; Supplier Part: C23138; Manufacturer: UNI-ROYAL(厚声); Supplier Footprint: 0603; JLCPCB Part Class: 基础库; Datasheet: https://atta.szlcsc.com/upload/public/pdf/source/20200306/C422600_1E6D84923E4A46A82E41ADD87F860B5C.pdf; Supplier: LCSC; Type: 厚膜电阻; Tolerance: ±1%; Power(Watts): 100mW; Overload Voltage (Max): 75V; Temperature Coefficient: ±100ppm/℃; Operating Temperature Range: -55℃~+155℃
U12 = CH334F_C5187527: Supplier Part: C5187527; Manufacturer: WCH(南京沁恒); Supplier Footprint: QFN-24(4x4); JLCPCB Part Class: 扩展库; Datasheet: https://atta.szlcsc.com/upload/public/pdf/source/20240313/0A90B4344DBFB1B295B73A4884A13F29.pdf; Supplier: LCSC
U13 = CH340X: Supplier Part: C3035748; Manufacturer: WCH(南京沁恒); Supplier Footprint: MSOP-10; JLCPCB Part Class: 扩展库; Datasheet: https://atta.szlcsc.com/upload/public/pdf/source/20230530/6E401E9554E9F5311886CC8B3F89B62E.pdf; Supplier: LCSC
U14 = E32-433T20S: 基于Semtech公司LoRa方案的无线串口模块（TTL电平），透明传输方式，工作在410～441MHz频段（默认433MHz），采用LoRa扩频技术。LoRa模块支持LoRa™扩频技术，LoRa™直序扩频技术具有更远的通讯距离，抗干扰能力强的优势，同时有极强的保密性。目前已经稳定量产，已经大量应用三表行业、物联网改造、智能家具等领域。; LCSC Part Name: 433MHz无线模块串口远距离收发LLCC68芯片射频透传通信超低功耗; Supplier Part: C2971738; Manufacturer: EBYTE(亿佰特); Supplier Footprint: SMD,16x26mm; JLCPCB Part Class: 扩展库; Datasheet: https://atta.szlcsc.com/upload/public/pdf/source/20220121/7E44F92F62719F01378B5EEDB9BA26BD.pdf; Supplier: LCSC
U15 = TJA1051T_C7432801: 类型:-;数据速率:-;; LCSC Part Name: 高速CAN收发器 TJA1051T; Supplier Part: C7432801; Manufacturer: Tokmas(托克马斯); Supplier Footprint: SOP-8; JLCPCB Part Class: 扩展库; Datasheet: https://atta.szlcsc.com/upload/public/pdf/source/20230625/004DEA3E98C57C3FE97F8CC2FD188F8A.pdf; Supplier: LCSC; Supply Voltage: 4.5V~5.5V; Operating Temperature: -40℃~+150℃
U16 = WAFER-GH1.25-4PLB: 插针结构:1x4P;间距:1.25mm;安装方式:立贴;参考系列:GH;总PIN数:4P;排数:1;每排PIN数:4;行距:-;额定电流:1A;触头材质:黄铜;触头镀层:-;工作温度:-25℃~+85℃;; LCSC Part Name: 1x4P 间距:1.25mm 立贴 系列:GH; Supplier Part: C3029370; Manufacturer: XUNPU(讯普); Supplier Footprint: SMD,P=1.25mm; JLCPCB Part Class: 扩展库; Datasheet: https://item.szlcsc.com/datasheet/WAFER-GH1.25-4PLB/3561382.html; Supplier: LCSC; Pins Structure: 1x4P; Pitch: 1.25mm; Mounting Type: 立贴; Reference Series: GH; Number of Pins: 4P; Number of Rows: 1; Number of PINs Per Row: 4; Current Rating: 1A; Contact Material: 黄铜; Operating Temperature: -25℃~+85℃; Voltage Rating: 125V; Plastic Material: LCP; Supplementary Features: 辅助焊脚; Color: 米色; Z-Height of the Board: 4.2mm; X-Length of Bottom Edge on Board (Spacing Line): 8.25mm; Y-Width of Bottom Edge on Board: 4.95mm
U17-U19 U23 U27 U34 = 3M螺丝孔
U20-U22 = SMTSOM340STR: M3x5.56xL4+1.53; LCSC Part Name: YIYUAN(怡远) 电路板表贴圆螺母柱 PCB贴片连接器 M3x5.56xL4+1.53mm 铁镀锡 SMTSOM340STR; Supplier Part: C5301788; Manufacturer: YIYUAN(怡远); Supplier Footprint: SMD; JLCPCB Part Class: 扩展库; Datasheet: https://item.szlcsc.com/datasheet/SMTSOM340STR/6053342.html; Supplier: LCSC; specifications: M3; surface treatment: 镀锡; material quality: 铁; length: 4mm
U26 = AHT20: AHT20温湿度传感器嵌入了适于回流焊的双列扁平无引脚SMD封装，传感器输出经过标定的数字信号，标准 I²C 格式。AHT20配有ASIC专用芯片、MEMS半导体电容式湿度传感元件和片上温度传感元件，使其性能大大提升，每一个传感器都经过校准和测试，并印有产品批号。; Supplier Part: C2757850; Manufacturer: 广州奥松; Supplier Footprint: SMD; JLCPCB Part Class: 扩展库; Datasheet: https://item.szlcsc.com/datasheet/AHT20/2874650.html; Supplier: LCSC
U31 U32 = DIN-603_C23689424: LCSC Part Name: DIN插座; Supplier Part: C23689424; Manufacturer: Legion(六钧); Supplier Footprint: 插件; JLCPCB Part Class: 扩展库; Datasheet: https://atta.szlcsc.com/upload/public/pdf/source/20240702/0160C5086853E535507D1610542C9395.pdf; Supplier: LCSC
USB1 = TYPE-C 16PIN 2MD(073): 连接器类型:Type-C;标准:-;公母:母;端口数量:1;触点数量:16P;安装方式:卧贴;额定电流 - 电源:5A;工作温度范围:-25℃~+85℃;; LCSC Part Name: Type-C 母 卧贴; Supplier Part: C2765186; Manufacturer: SHOU HAN(首韩); Supplier Footprint: SMD; JLCPCB Part Class: 扩展库; Datasheet: https://atta.szlcsc.com/upload/public/pdf/source/20211123/39B17C16241EAC15C5E277BDA434118E.pdf; Supplier: LCSC; Connector Type: Type-C; Gender: 母; Number of Ports: 1; Number of Contacts: 16P; Mounting Style: 卧贴; Current Rating - Power (Max): 5A; Operating Temperature Range: -25℃~+85℃
X2 = HY12MSMD5032TCOB1R10: 频率:12MHz;外接负载电容:20pF;频率稳定度(全温):±10ppm;; LCSC Part Name: 12MHz 20pF; Supplier Part: C7275156; Manufacturer: Huiyuan crystal(惠源晶工); Supplier Footprint: SMD5032; JLCPCB Part Class: 扩展库; Datasheet: https://atta.szlcsc.com/upload/public/pdf/source/20230530/963B6F826635DBFEE7193C53B0A534DA.pdf; Supplier: LCSC; External load capacitor: 20pF; Frequency Stability(Full temperature range): ±10ppm; Equivalent Series Resistance (ESR): 50Ω
C105 = 1206B271K202CT: 容值:270pF;精度:±10%;额定电压:2kV;温度系数:X7R;; LCSC Part Name: 270pF ±10% 2kV; Supplier Part: C3881185; Manufacturer: Walsin(华新科); Supplier Footprint: 1206; JLCPCB Part Class: 扩展库; Datasheet: https://item.szlcsc.com/datasheet/1206B271K202CT/4449713.html; Supplier: LCSC; Tolerance: ±10%; Voltage Rating: 2kV; Temperature Coefficient: X7R
Q5 = AO3401A_C15127: 类型:1个P沟道;漏源电压(Vdss):30V;连续漏极电流(Id):4A;导通电阻(RDS(on)@Vgs,Id):44mΩ@10V,4.3A;功率(Pd):1.4W;阈值电压(Vgs(th)@Id):1.3V@250uA;; LCSC Part Name: 1个P沟道 耐压:30V 电流:4A; Supplier Part: C15127; Manufacturer: AOS; Supplier Footprint: SOT-23; JLCPCB Part Class: 基础库; Datasheet: https://atta.szlcsc.com/upload/public/pdf/source/20160507/1462613609053.pdf; Supplier: LCSC; Type: 1个P沟道; Drain Source Voltage (Vdss): 30V; Continuous Drain Current (Id): 4A; Drain Source On Resistance (RDS(on)@Vgs,Id): 44mΩ@10V,4.3A; Power Dissipation (Pd): 1.4W; Gate Threshold Voltage (Vgs(th)@Id): 1.3V@250uA; Total Gate Charge (Qg@Vgs): 12.2nC@4.5V; Input Capacitance (Ciss@Vds): 1.2nF@15V; Operating Temperature: -55℃~+150℃@(Tj)
Q6 = MMBT3904(RANGE:100-300): 晶体管类型:NPN;集电极电流(Ic):200mA;集射极击穿电压(Vceo):40V;耗散功率(Pd):200mW;直流电流增益(hFE):100@10mA,1V;; LCSC Part Name: hfe=100~300; Supplier Part: C20526; Manufacturer: CJ(江苏长电/长晶); Supplier Footprint: SOT-23; JLCPCB Part Class: 基础库; Datasheet: https://atta.szlcsc.com/upload/public/pdf/source/20220704/70F575FB75061E03F919270A6BB8BA7F.pdf; Supplier: LCSC; type: NPN; Current - Collector(Ic): 200mA; Collector - Emitter Voltage VCEO: 40V; Pd - Power Dissipation: 200mW; DC Current Gain: 100@10mA,1V; Transition frequency(fT): 300MHz; Current - Collector Cutoff: 100nA; Vce Saturation(VCE(sat)): 300mV
Q7 = S8050 J3Y(RANGE:200-350): 晶体管类型:NPN;集电极电流(Ic):500mA;集射极击穿电压(Vceo):25V;耗散功率(Pd):300mW;直流电流增益(hFE):200@500mA,1V;; LCSC Part Name: H档(200-350) NPN 电流:0.5A 电压:25V; Supplier Part: C2146; Manufacturer: CJ(江苏长电/长晶); Supplier Footprint: SOT-23; JLCPCB Part Class: 基础库; Datasheet: https://item.szlcsc.com/datasheet/S8050%2520J3Y(RANGE%253A200-350)/2503.html; Supplier: LCSC; type: NPN; Current - Collector(Ic): 500mA; Collector - Emitter Voltage VCEO: 25V; Pd - Power Dissipation: 300mW; DC Current Gain: 200@500mA,1V; Transition frequency(fT): 150MHz; Current - Collector Cutoff: 100nA; Vce Saturation(VCE(sat)): 600mV@500mA,50mA; Operating Temperature: -55℃~+150℃; Emitter-Base Voltage(Vebo): 5V; Number: 1个NPN; Transistor Type: NPN; Collector Current (Ic): 500mA; Collector-Emitter Breakdown Voltage (Vceo): 25V; Power Dissipation (Pd): 300mW; DC Current Gain (hFE@Ic,Vce): 200@50mA,1V; Transition Frequency (fT): 150MHz; Collector Cut-Off Current (Icbo): 100nA; Collector-Emitter Saturation Voltage (VCE(sat)@Ic,Ib): 600mV@500mA,50mA
R68 = 0805W8F1005T5E: 电阻类型:厚膜电阻;阻值:10MΩ;精度:±1%;功率:125mW;最大工作电压:150V;温度系数:±100ppm/℃;; LCSC Part Name: 10MΩ ±1% 125mW 厚膜电阻; Supplier Part: C26108; Manufacturer: UNI-ROYAL(厚声); Supplier Footprint: 0805; JLCPCB Part Class: 扩展库; Datasheet: https://atta.szlcsc.com/upload/public/pdf/source/20200306/C422600_1E6D84923E4A46A82E41ADD87F860B5C.pdf; Supplier: LCSC; Type: 厚膜电阻; Tolerance: ±1%; Power(Watts): 125mW; Overload Voltage (Max): 150V; Temperature Coefficient: ±100ppm/℃; Operating Temperature Range: -55℃~+155℃
R70 R72 = 0603WAF1003T5E: 电阻类型:厚膜电阻;阻值:100kΩ;精度:±1%;功率:100mW;最大工作电压:75V;温度系数:±100ppm/℃;; LCSC Part Name: 100kΩ ±1% 100mW 厚膜电阻; Supplier Part: C25803; Manufacturer: UNI-ROYAL(厚声); Supplier Footprint: 0603; JLCPCB Part Class: 基础库; Datasheet: https://atta.szlcsc.com/upload/public/pdf/source/20200306/C422600_1E6D84923E4A46A82E41ADD87F860B5C.pdf; Supplier: LCSC; Type: 厚膜电阻; Tolerance: ±1%; Power(Watts): 100mW; Overload Voltage (Max): 75V; Temperature Coefficient: ±100ppm/℃; Operating Temperature Range: -55℃~+155℃
R71 = 0805W8F1003T5E: 电阻类型:厚膜电阻;阻值:100kΩ;精度:±1%;功率:125mW;最大工作电压:150V;温度系数:±100ppm/℃;; LCSC Part Name: 100kΩ ±1% 125mW 厚膜电阻; Supplier Part: C149504; Manufacturer: UNI-ROYAL(厚声); Supplier Footprint: 0805; JLCPCB Part Class: 基础库; Datasheet: https://atta.szlcsc.com/upload/public/pdf/source/20200306/C422600_1E6D84923E4A46A82E41ADD87F860B5C.pdf; Supplier: LCSC; Type: 厚膜电阻; Tolerance: ±1%; Power(Watts): 125mW; Overload Voltage (Max): 150V; Temperature Coefficient: ±100ppm/℃; Operating Temperature Range: -55℃~+155℃
R73 R74 = 0603WAF1001T5E: 电阻类型:厚膜电阻;阻值:1kΩ;精度:±1%;功率:100mW;最大工作电压:75V;温度系数:±100ppm/℃;; LCSC Part Name: 1kΩ ±1% 100mW 厚膜电阻; Supplier Part: C21190; Manufacturer: UNI-ROYAL(厚声); Supplier Footprint: 0603; JLCPCB Part Class: Basic Part; Datasheet: https://atta.szlcsc.com/upload/public/pdf/source/20200306/C422600_1E6D84923E4A46A82E41ADD87F860B5C.pdf; Supplier: LCSC; Type: 厚膜电阻; Tolerance: ±1%; Power(Watts): 100mW; Overload Voltage (Max): 75V; Temperature Coefficient: ±100ppm/℃; Operating Temperature Range: -55℃~+155℃
U24 = 反激电源模块_5v升压400v
U25 = 盖革计数管

## Nets
24V: D17.1(C) D19.1(C) F3.1 F4.1 ; also on sheet 2
GND: C58.2 C59.1 C60.1 C61.1 C62.2 C63.1 C64.2 C65.1 C66.2 C71.2 C72.1 C73.1 C74.1 C77.2 C78.2 C79.1 C80.1 C81.1 C82.1 C83.1 C84.1 C85.1 C86.1 C87.1 C88.1 C89.1 C90.1 C91.1 C92.2 C93.2 C94.1 C95.1 C96.2 C97.2 C98.1 C99.1 C100.1 C101.2 C102.2 C104.1 C105.1 C106.2 C107.2 C341.2 C342.1 C343.1 CN1.2 CN1.10 CN1.11 D8.3(GND) D8.8(GND) D9.3(GND) D9.8(GND) D10.2(GND) D12.3(A) D17.2(A) D19.2(A) FPC1.3 FPC1.16 FPC1.18 FPC1.19 FPC1.44 FPC1.45 FPC1.46 FPC1.49 FPC1.50 FPC1.51 FPC1.52 LED2.2(GND) LED3.2(GND) LED4.2(GND) LED5.2(GND) LED6.2(GND) LED7.2(GND) LED8.2(GND) LED9.2(GND) Q4.2(E) Q6.2(E) Q7.2(E) R34.2 R38.1 R39.1 R40.2 R41.1 R42.1 R43.1 R50.2 R54.2 R55.1 R56.1 R71.1 R72.2 R75.1 U10.1(GND) U10.4(GND) U10.21(GND) U10.23(GND) U10.56(GND) U10.57(GND) U10.58(GND) U10.59(GND) U11.3(AGND) U11.9(AGND) U11.14(AGND) U11.16(AGND) U11.19(AGND) U11.29(GND) U11.48(AGND) U12.25(GND) U13.3(GND) U14.2(GND) U14.8(GND) U14.11(GND) U14.13(GND) U14.14(GND) U14.15(GND) U14.16(GND) U14.19(GND) U14.26(GND) U15.2(GND) U15.8(S) U16.2 U16.5 U16.6 U17.1 U19.1 U20.1 U20.2 U20.3 U20.4 U21.1 U21.2 U21.3 U21.4 U22.1 U22.2 U22.3 U22.4 U24.2(GND) U24.4(GND) U26.5(GND) U31.5 U31.6 U32.5 U32.6 USB1.1(GND) USB1.12(GND) Y2.2(GND) Y2.4(GND) ; also on sheet 2 3
PGND: D7.2(10)(10) D7.10 D7.29(EH) D7.30(EH) U18.1 U23.1 U27.1 U31.7 U31.8 U31.9 U32.7 U32.8 U32.9 U34.1 USB1.13(SHELL) USB1.14(SHELL) ; also on sheet 2
VBUS: D10.5(VCC) USB1.2(VBUS) USB1.11(VBUS) ; also on sheet 2
VCC_3V3: C58.1 C59.2 C78.1 C79.2 C88.2 C89.2 C90.2 C91.2 C92.1 C93.1 C102.1 FPC1.1 FPC1.2 L6.1 L7.1 L10.2 R57.2 R58.1 R59.1 R60.1 R61.1 R62.1 R67.1 R76.2 R77.1 R78.2 R79.2 U12.20(VDD33) U13.7(VCC) U13.10(V3) U16.1 ; also on sheet 2 3
VCC_5V: C86.2 C87.2 C94.2 C95.2 C98.2 C99.2 C103.1 C106.1 C107.1 CN1.1 LED2.4(VDD) LED3.4(VDD) LED4.4(VDD) LED5.4(VDD) LED6.4(VDD) LED7.4(VDD) LED8.4(VDD) LED9.4(VDD) Q5.2(S) R70.1 U12.19(V5) U14.25(VCC) U15.3(VCC) ; also on sheet 2 3
BOOT0: R55.2 U13.6(TNOW/DTR#) ; also on sheet 3
CAN_RX: U15.4(RXD) ; also on sheet 3
CAN_TX: U15.1(TXD) ; also on sheet 3
CANH: D12.1(C) L9.1 R63.2 U31.4 U32.4
CANL: D12.2(C) L9.2 R64.1 U31.2 U32.2
COUNT: Q6.3(C) R67.2 ; also on sheet 3
DN: D10.3(IO2) D10.4(IO4) L8.1 USB1.5(DN2) USB1.7(DN1)
DP: D10.1(IO1) D10.6(IO3) L8.2 USB1.6(DP1) USB1.8(DP2)
HLK_EN: R32.1 ; also on sheet 3
HV_EN: R74.2 ; also on sheet 3
I2C4_SCL: R78.1 U16.3 U26.3(SCL) ; also on sheet 3
I2C4_SDA: R79.1 U16.4 U26.4(SDA) ; also on sheet 3
KEY_EN: FPC1.6 ; also on sheet 3
KEY_LEFT_RIGHT: FPC1.5 ; also on sheet 3
KEY_SET: FPC1.4 ; also on sheet 3
KEY_UP_DOWN: FPC1.7 ; also on sheet 3
LCD_CS: FPC1.11 ; also on sheet 3
LCD_PWM: FPC1.8 ; also on sheet 3
LCD_RST: FPC1.12 ; also on sheet 3
LCD_SCL: FPC1.9 ; also on sheet 3
LCD_SDA: FPC1.10 ; also on sheet 3
LCD_VCC: C101.1 FPC1.47 FPC1.48 L10.1
LINKCAT0: D7.12(LED1-) D7.13(LED2-) U10.13(EPHY_LED0)
LINKCAT1: D7.2(12)(LED3-) D7.2(13)(LED4-) U10.12(EPHY_LED1)
LORA_AUX: U14.24(AUX) ; also on sheet 3
LORA_M0: R60.2 U14.20(M0) ; also on sheet 3
LORA_M1: R61.2 U14.21(M1) ; also on sheet 3
LORA_RXD: U14.22(RXD) ; also on sheet 3
LORA_TXD: R62.2 U14.23(TXD) ; also on sheet 3
LTDC_B0: FPC1.27 ; also on sheet 3
LTDC_B1: FPC1.26 ; also on sheet 3
LTDC_B2: FPC1.25 ; also on sheet 3
LTDC_B3: FPC1.24 ; also on sheet 3
LTDC_B4: FPC1.23 ; also on sheet 3
LTDC_B5: FPC1.22 ; also on sheet 3
LTDC_B6: FPC1.21 ; also on sheet 3
LTDC_B7: FPC1.20 ; also on sheet 3
LTDC_CLK: FPC1.17 ; also on sheet 3
LTDC_DE: FPC1.13 ; also on sheet 3
LTDC_G0: FPC1.35 ; also on sheet 3
LTDC_G1: FPC1.34 ; also on sheet 3
LTDC_G2: FPC1.33 ; also on sheet 3
LTDC_G3: FPC1.32 ; also on sheet 3
LTDC_G4: FPC1.31 ; also on sheet 3
LTDC_G5: FPC1.30 ; also on sheet 3
LTDC_G6: FPC1.29 ; also on sheet 3
LTDC_G7: FPC1.28 ; also on sheet 3
LTDC_HSYNC: FPC1.14 ; also on sheet 3
LTDC_R0: FPC1.43 ; also on sheet 3
LTDC_R1: FPC1.42 ; also on sheet 3
LTDC_R2: FPC1.41 ; also on sheet 3
LTDC_R3: FPC1.40 ; also on sheet 3
LTDC_R4: FPC1.39 ; also on sheet 3
LTDC_R5: FPC1.38 ; also on sheet 3
LTDC_R6: FPC1.37 ; also on sheet 3
LTDC_R7: FPC1.36 ; also on sheet 3
LTDC_VSYNC: FPC1.15 ; also on sheet 3
MCU_RST: R29.2 U13.4(RTS#) ; also on sheet 3
MCU_UART1_RX: U13.8(TXD) ; also on sheet 3
MCU_UART1_TX: U13.9(RXD) ; also on sheet 3
MCU_UART3_RX: CN1.5 ; also on sheet 3
MCU_UART3_TX: CN1.4 ; also on sheet 3
MDI_RD+: C69.2 R46.2 U10.48(MDI_RP_P3)
MDI_RD-: C67.2 R47.2 U10.49(MDI_RN_P3)
MDI_TD+: C70.1 U10.46(MDI_TP_P3)
MDI_TD-: C68.1 U10.47(MDI_TN_P3)
PHY_3V3: C60.2 C61.2 L6.2 R25.2 R26.1 R28.2 R30.2 R31.1 R33.2 R81.1 U10.2(3.3VD) U10.3(3.3VD)
PHY_RST: C63.2 R26.2 R29.1 U10.14(PORST_N)
PM25_RST: CN1.6 R76.1 ; also on sheet 3
RD+: D7.4(MDI1+) D8.4(IO3) D8.7(NC) U10.34(MDI_RP_P0)
RD-: D7.7(MDI1-) D8.5(IO4) D8.6(NC) U10.35(MDI_RN_P0)
STM32_D+: U12.12(DP1) U13.1(UD+)
STM32_D-: U12.11(DM1) U13.2(UD-)
STM32_OTG_D+: U12.10(DP2) ; also on sheet 3
STM32_OTG_D-: U12.9(DM2) ; also on sheet 3
TD+: D7.2(MDI0+) D8.1(IO1) D8.10(NC) U10.36(MDI_TP_P0)
TD-: D7.3(MDI0-) D8.2(IO2) D8.9(NC) U10.37(MDI_TN_P0)
TPRX+: D7.2(4)(MDI1+) D9.4(IO3) D9.7(NC) U10.40(MDI_RP_P1)
TPRX-: D7.2(7)(MDI1-) D9.5(IO4) D9.6(NC) U10.41(MDI_RN_P1)
TPTX+: D7.2(2)(MDI0+) D9.1(IO1) D9.10(NC) U10.38(MDI_TP_P1)
TPTX-: D7.2(3)(MDI0-) D9.2(IO2) D9.9(NC) U10.39(MDI_TN_P1)
USB_D+: L8.3 U12.15(DPU)
USB_D-: L8.4 U12.14(DMU)
WDT_RST_N: C65.2 Q4.3(C) R31.2 U10.8(WDT_RST_N)
WLAN_3V3: C66.1 C71.1 C80.2 C81.2 C82.2 C83.2 C84.2 C85.2 L7.2 R35.1 R36.1 R37.1 R44.1 R45.1 R80.1 U11.4(AVDD) U11.8(AVDD) U11.11(AVDD) U11.15(AVDD) U11.17(AVDD) U11.21(AVDD) U11.28(VDD)
WLAN_ACT: R51.1 ; also on sheet 3
WLAN_CS: U11.32(SCSn) ; also on sheet 3
WLAN_DUP: R52.1 ; also on sheet 3
WLAN_INT: R45.2 U11.36(INTn)
WLAN_LINE: R53.1 ; also on sheet 3
WLAN_MISO: U11.34(MISO) ; also on sheet 3
WLAN_MOSI: U11.35(MOSI) ; also on sheet 3
WLAN_RST: R44.2 U11.37(RSTn)
WLAN_RXN: C68.2 R48.2 U11.5(RXN)
WLAN_RXP: C70.2 R49.2 U11.6(RXP)
WLAN_SCLK: U11.33(SCLK) ; also on sheet 3
WLAN_TXN: C67.1 U11.1(TXN)
WLAN_TXP: C69.1 U11.2(TXP)
WLAN_XI: C73.2 U11.30(XI/CLKIN) Y2.3(OSC2)
WLAN_XO: C72.2 U11.31(XO) Y2.1(OSC1)
WS2812B_PWM: LED2.3(DI) ; also on sheet 3
$4N1560: D7.11(LED1+) R28.1
$4N1561: D7.2(11)(LED3+) R33.1
$4N1563: D7.2(14)(LED4+) R30.1
$4N1564: D7.14(LED2+) R25.1
$4N1566: C64.1 D7.2(1)(CTC)
$4N1567: C62.1 D7.1(CTC)
$4N4969: Q4.1(B) R32.2 R34.1
$4N6211: R40.1 U11.10(EXRES1)
$4N6212: R50.1 U11.23(RSVD)
$4N6213: C77.1 U11.22(1V2O)
$4N6214: C74.2 U11.20(TOCAP)
$4N6217: R35.2 U11.45(PMODE0)
$4N6218: R36.2 U11.44(PMODE1)
$4N6219: R37.2 U11.43(PMODE2)
$4N6221: R38.2 U11.42(RSVD)
$4N6222: R39.2 U11.41(RSVD)
$4N6223: R41.2 U11.40(RSVD)
$4N6224: R42.2 U11.39(RSVD)
$4N6225: R43.2 U11.38(RSVD)
$4N6246: R52.2 U11.26(DUPLED)
$4N6247: R51.2 U11.27(ACTLED)
$4N6248: R53.2 U11.25(LINKLED)
$4N7242: C343.2 R48.1 R49.1 R80.2
$4N7548: C342.2 R46.1 R47.1 R81.2
$5N520: C97.1 R63.1 R64.2
$5N525: C100.2 L9.3 U15.6(CANL)
$5N526: C96.1 L9.4 U15.7(CANH)
$5N1993: R59.2 U12.1(OVCUR#)
$5N1996: R58.2 U12.24(PWREN#)
$5N1997: U12.4(XI) X2.1
$5N1998: U12.3(XO) X2.2(GND)
$5N1999: LED1.2(+) R57.1
$5N2000: LED1.1(-) U12.21(LED4/SDA)
$5N2534: R56.2 USB1.10(CC2)
$5N2535: R54.1 USB1.4(CC1)
$5N14196: LED8.1(DO) LED9.3(DI)
$5N14202: LED7.1(DO) LED8.3(DI)
$5N14222: LED6.1(DO) LED7.3(DI)
$5N14254: LED5.1(DO) LED6.3(DI)
$5N14278: LED4.1(DO) LED5.3(DI)
$5N14304: LED3.1(DO) LED4.3(DI)
$5N14335: LED2.1(DO) LED3.3(DI)
$5N32411: F3.2 U32.1 U32.3
$5N32849: C341.1 R77.2 U26.2(VDD)
$5N49929: F4.2 U31.1 U31.3
$7N536: C105.2 R69.2 R71.2 U25.3(2) U25.4(1)
$7N537: Q6.1(B) R69.1 R72.1
$7N545: R68.2 U25.1 U25.2
$7N701: R68.1 U24.3(HV)
$7N1241: C104.2 Q5.3(D) U24.1(5V)
$7N1614: C103.2 Q5.1(G) R70.2 R73.2
$7N1755: Q7.1(B) R74.1 R75.2
$7N1796: Q7.3(C) R73.1

Not connected (* = marked no-connect by the designer): CN1 3* 7* 8*; D7 2(5)(MDI2+)* 2(6)(MDI2-)* 2(8)(MDI3+)* 2(9)(MDI3-)* 5(MDI2+)* 6(MDI2-)* 8(MDI3+)* 9(MDI3-)*; LED9 1(DO)*; U10 5(SPI_CS0)* 6(REF_CLK0)* 7(PERST_N)* 9(EPHY_LED4)* 10(EPHY_LED3)* 11(EPHY_LED2)* 15(UART_TXD1)* 16(UART_RXD1)* 17(I2S_SDI)* 18(I2S_SDO)* 19(I2S_WS)* 20(I2S_CLK)* 22(ANT)* 24(I2C_SCLK)* 25(I2C_SD)* 26(SPI_CS1)* 27(SPI_CLK)* 28(SPI_MISO)* 29(SPI_MOSI)* 30(GPIO0)* 31(UART_TXD0)* 32(UART_RXD0)* 33(WLED_N)* 42(MDI_RP_P2)* 43(MDI_RN_P2)* 44(MDI_TP_P2)* 45(MDI_TN_P2)* 50(MDI_RP_P4)* 51(MDI_RN_P4)* 52(MDI_TP_P4)* 53(MDI_TN_P4)* 54(USB_DP)* 55(USB_DM)*; U11 7(DNC)* 12(NC)* 13(NC)* 18(VBG)* 24(SPDLED)* 46(NC)* 47(NC)*; U12 2(NC.)* 5(DM4)* 6(DP4)* 7(DM3)* 8(DP3)* 13(LED3/SCL)* 16(RESET#/CDP)* 17(NC)* 18(PSELF)* 22(LED1)* 23(LED2)*; U13 5(CTS#)*; U14 1(NC)* 3(NC)* 4(NC)* 5(NC)* 6(NC)* 7(NC)* 12(ANT); U15 5(N.C.)*; U26 1(NC)* 6(NC)*; U35 1(MDIRP) 2(MDIRN) 3(GND) 4(AVDD33) 5(MDITP) 6(MDITN) 7(NC) 8(AVDD33) 9(GND) 10(NC) 11(NC) 12(NC) 13(NC) 14(GND) 15(NC) 16(GND) 17(NC) 18(NC) 19(GND) 20(AVDDK) 21(VDDIO) 22(DVDDK) 23(NC) 24(LED_SPD) 25(LED_LINK) 26(LED_DUP) 27(LED_ACT) 28(VDDIO) 29(GND) 30(XI) 31(XO) 32(SCS) 33(SCK) 34(SDO) 35(SDI) 36(INT) 37(RSTB) 38(NC) 39(NC) 40(NC) 41(NC) 42(NC) 43(PMOD2) 44(PMOD1) 45(PMOD0) 46(NC) 47(NC) 48(GND); USB1 3(SBU2)* 9(SBU1)*

## Notes on the sheets
sheet 4
- HLK-7688A 平均电流188mA  最大值 360mA
- 靠近HLK-7688A摆放
- 靠近W5500摆放
sheet 5
- USB转TTL（自带一键下载）
- USB烧录电路
- 报警灯电路
- E32-433T20S LORA接口电路
- CAN驱动电路
- 需修改TVS选型和齐纳二极管参数
- D5激光PM2.5传感器模块接口电路
- 空气传感器模块
- 声光报警接口
- 屏幕按键板接口
- 空气检测板螺丝柱
